# EAGLE design schockink (EAGLE 9.2.0)

## Sheet 1 of 5: PSU
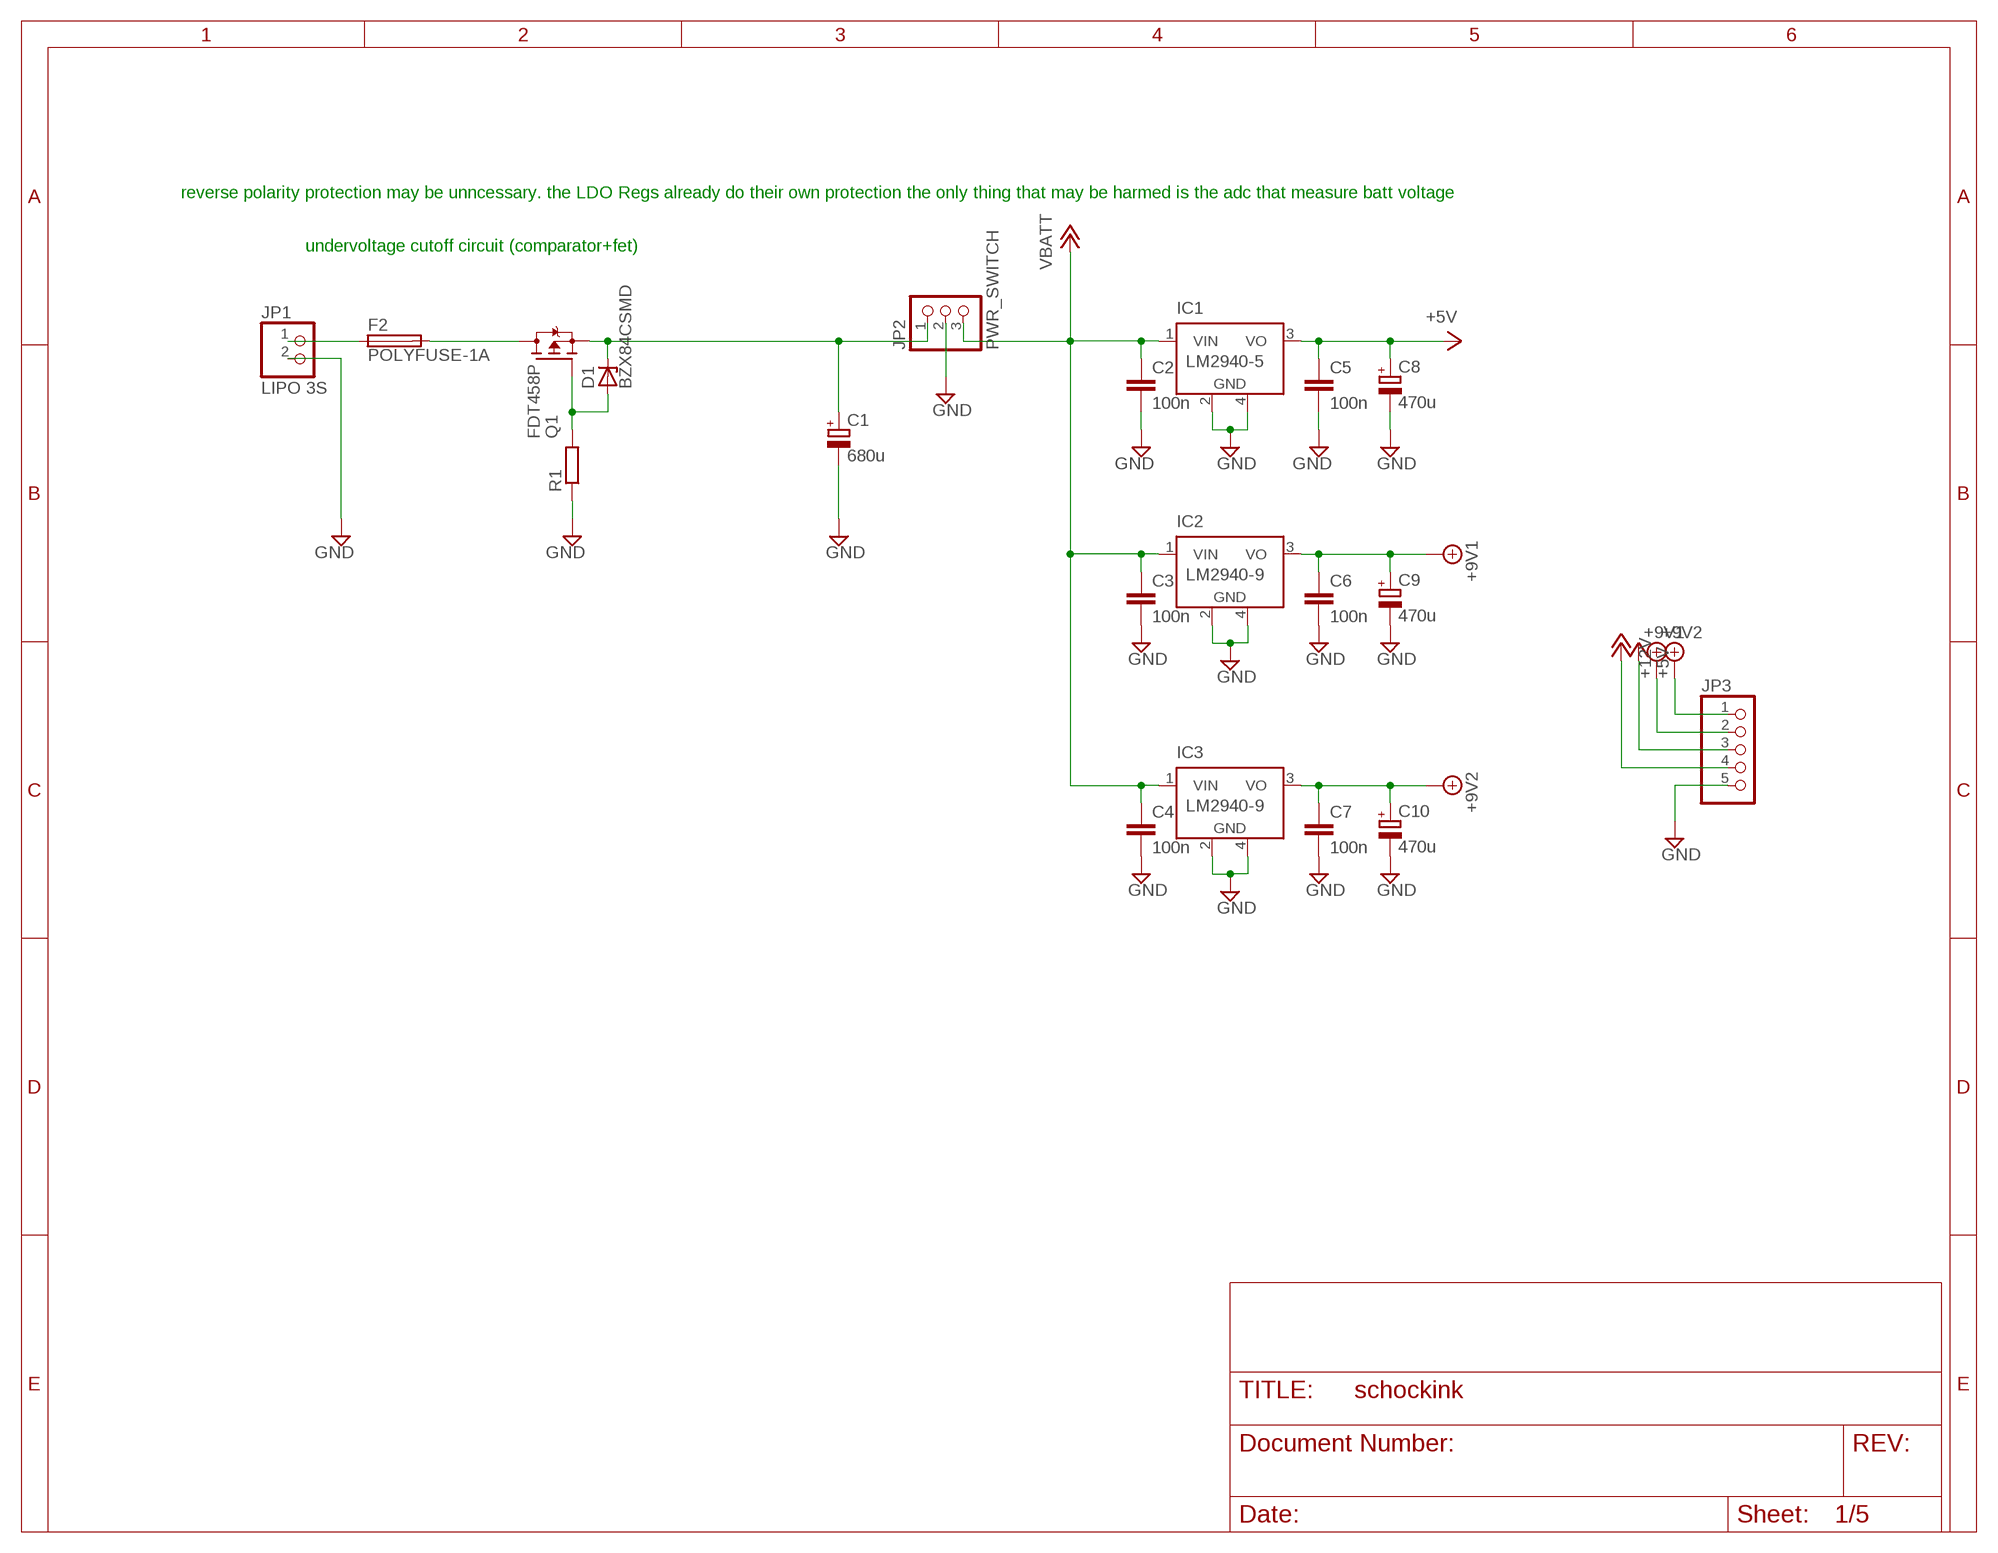
[diagram p0: schematic, sheet 1]

### Parts
C1  680u  CPOL-EUUD-8X10  [UD-8X10_NICHICON]
C2  100n  C-EUC2012  [C2012]
C3  100n  C-EUC2012  [C2012]
C4  100n  C-EUC2012  [C2012]
C5  100n  C-EUC2012  [C2012]
C6  100n  C-EUC2012  [C2012]
C7  100n  C-EUC2012  [C2012]
C8  470u  CPOL-EUUD-6,3X7,7  [UD-6,3X7,7_NICHICON]
C9  470u  CPOL-EUUD-6,3X7,7  [UD-6,3X7,7_NICHICON]
C10  470u  CPOL-EUUD-6,3X7,7  [UD-6,3X7,7_NICHICON]
D1  BZX84CSMD  [TO236]
F2  POLYFUSE-1A  [R1210]
IC1  LM2940-5  LM2936MP-3.3  [SOT223]
IC2  LM2940-9  LM2936MP-3.3  [SOT223]
IC3  LM2940-9  LM2936MP-3.3  [SOT223]
JP1  LIPO 3S  PINHD-1X2  [1X02]
JP2  PWR_SWITCH  PINHD-1X3  [1X03]
JP3  PINHD-1X5  [1X05]
Q1  FDT458P  [SOT223]
R1  R-EU_M2012  [M2012]

### Nets
+5V: C5.1 C8.+ IC1.3(VO) JP3.3 ; also sheet 2,3,4,5
+9V1: C6.1 C9.+ IC2.3(VO) JP3.2 ; also sheet 4
+9V2: C7.1 C10.+ IC3.3(VO) JP3.1 ; also sheet 4
+VBATT: C2.1 C3.1 C4.1 IC1.1(VIN) IC2.1(VIN) IC3.1(VIN) JP2.3 JP3.4 ; supply symbol labelled VBATT, +12V ; also sheet 2,5
GND: C1.- C2.2 C3.2 C4.2 C5.2 C6.2 C7.2 C8.- C9.- C10.- IC1.2(GND) IC1.4(GND) IC2.2(GND) IC2.4(GND) IC3.2(GND) IC3.4(GND) JP1.2 JP2.2 JP3.5 R1.1 ; also sheet 2,3,4,5
N$31: F2.1 JP1.1
N$33: F2.2 Q1.2(D) Q1.4(D)
N$43: D1.A Q1.1(G) R1.2
N$78: C1.+ D1.C JP2.1 Q1.3(S)

### Notes on the sheet
- reverse polarity protection may be unncessary. the LDO Regs already do their own protection the only thing that may be harmed is the adc that measure batt voltage
- undervoltage cutoff circuit (comparator+fet)

## Sheet 2 of 5: ATMEGA MCU
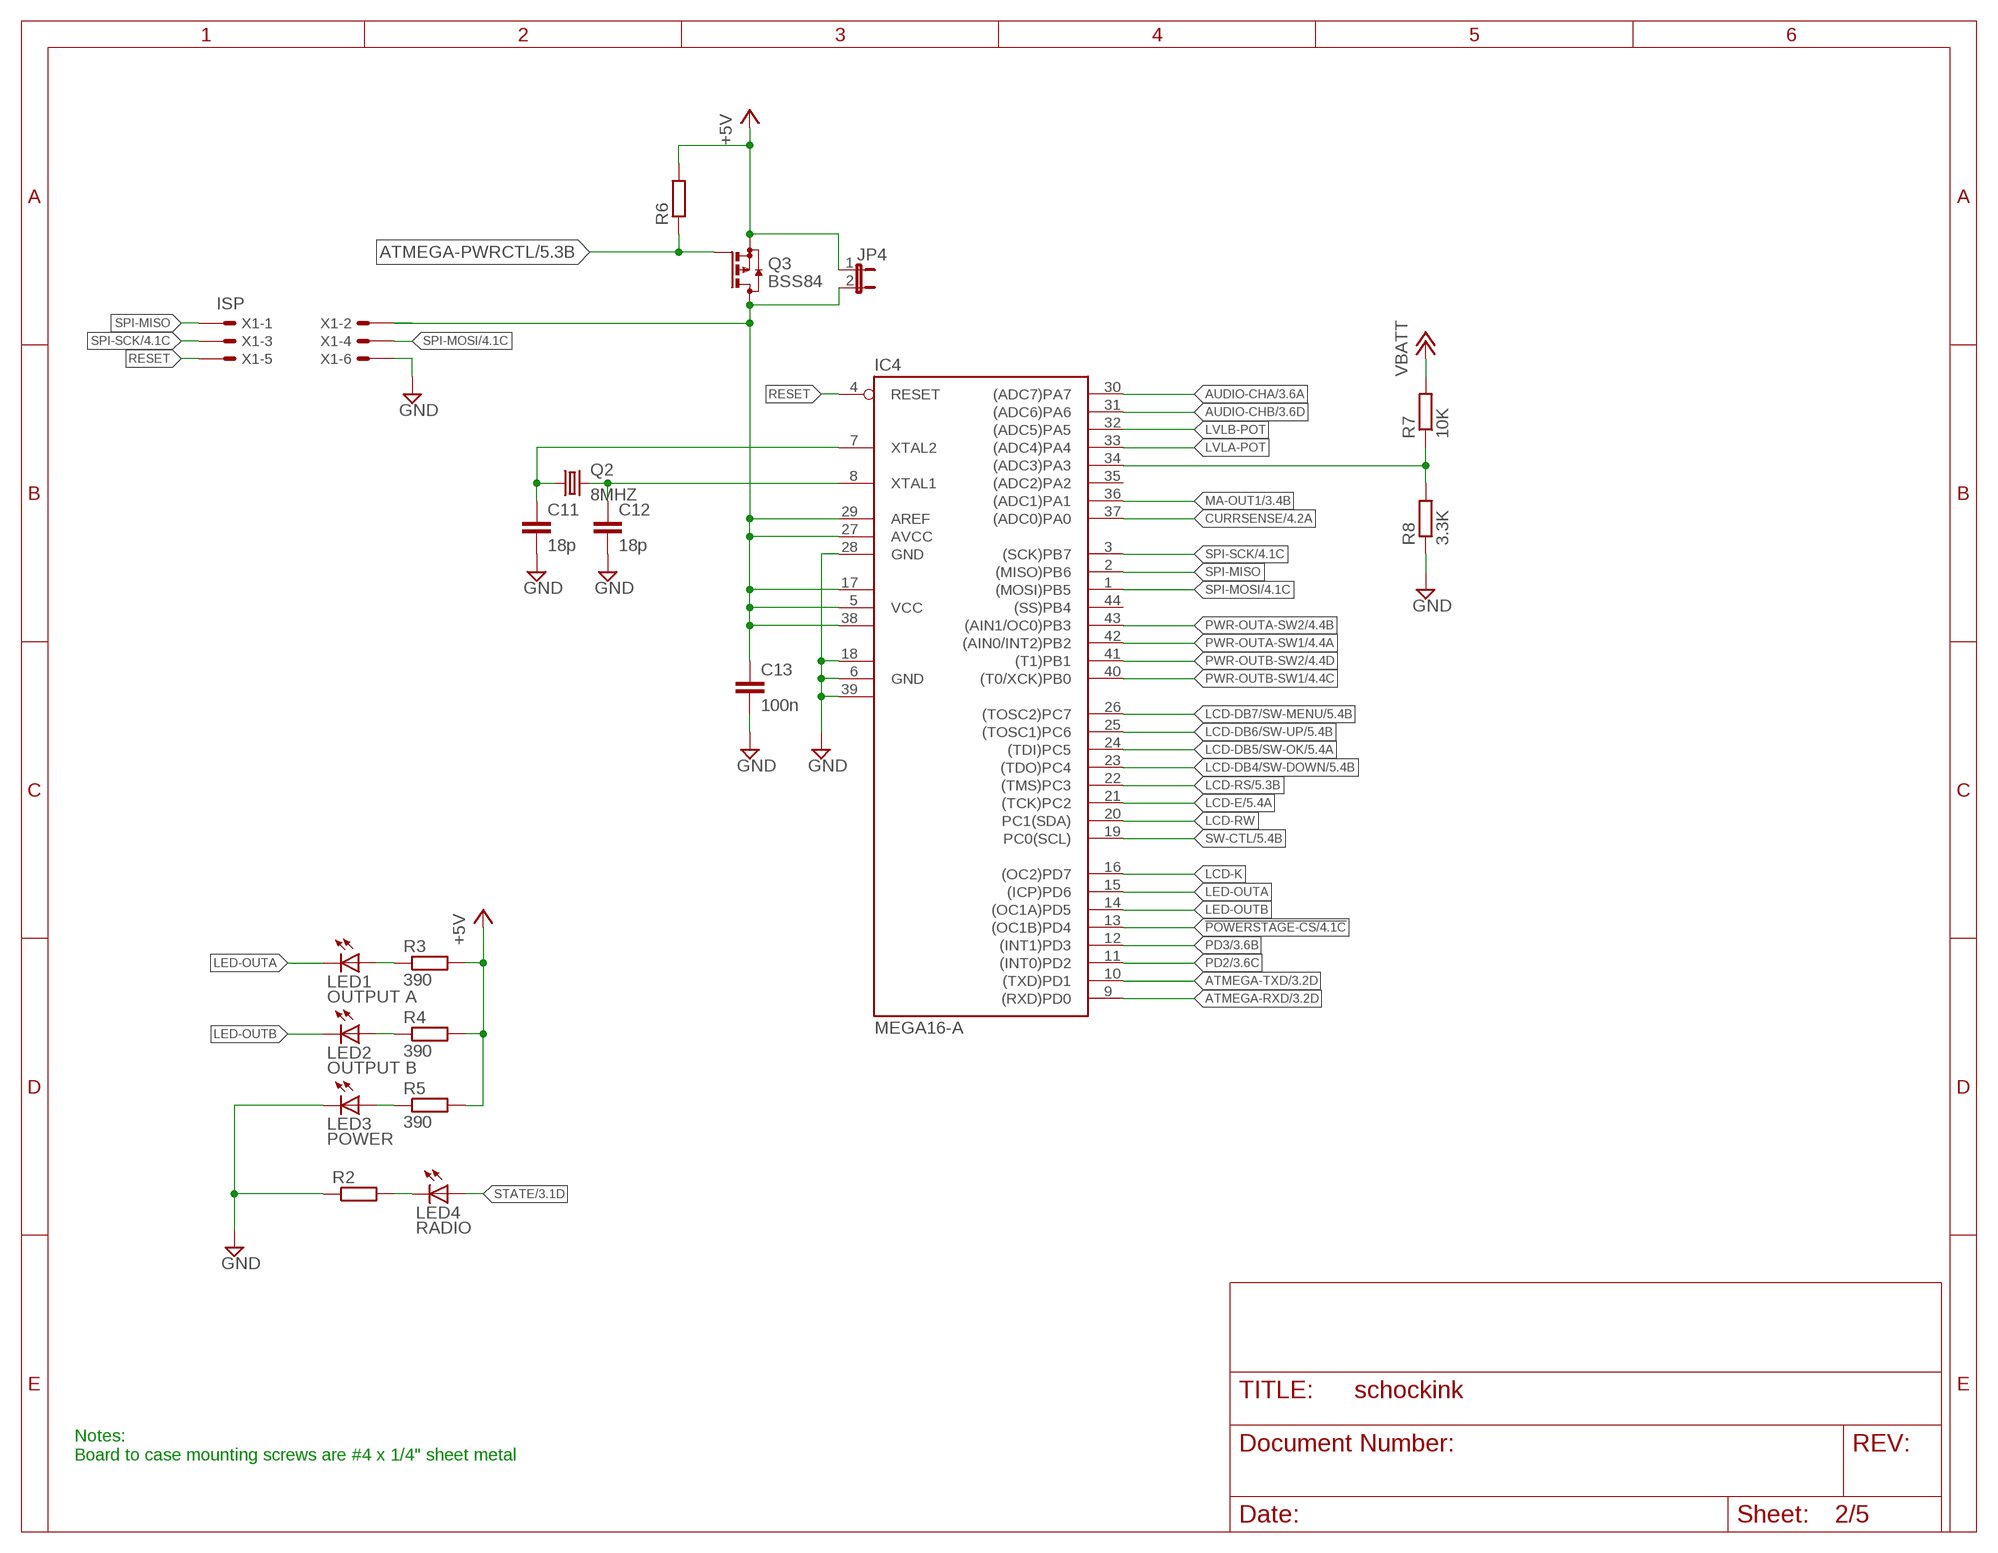
[diagram p1: schematic, sheet 2]

### Parts
C11  18p  C-EUC2012  [C2012]
C12  18p  C-EUC2012  [C2012]
C13  100n  C-EUC2012  [C2012]
IC4  MEGA16-A  [TQFP44]
JP4  JP1E  [JP1]
LED1  OUTPUT A  LEDCHIPLED_0805  [CHIPLED_0805]
LED2  OUTPUT B  LEDCHIPLED_0805  [CHIPLED_0805]
LED3  POWER  LEDCHIPLED_0805  [CHIPLED_0805]
LED4  RADIO  LEDCHIPLED_0805  [CHIPLED_0805]
Q2  8MHZ  CRYSTALCTS406  [CTS406]
Q3  BSS84  [SOT23]
R2  R-EU_M2012  [M2012]
R3  390  R-EU_M2012  [M2012]
R4  390  R-EU_M2012  [M2012]
R5  390  R-EU_M2012  [M2012]
R6  R-EU_M2012  [M2012]
R7  10K  R-EU_M2012  [M2012]
R8  3.3K  R-EU_M2012  [M2012]
X1  ISP  057-006-1  [057-006-1]

### Nets
!POWERSTAGE-CS: IC4.13((OC1B)PD4) ; also sheet 4,5
+5V: JP4.1 Q3.2(S) R3.2 R4.2 R5.2 R6.2 ; also sheet 1,3,4,5
+VBATT: R7.2 ; supply symbol labelled VBATT ; also sheet 1,5
ATMEGA-PWRCTL: Q3.1(G) R6.1 ; also sheet 5
ATMEGA-RXD: IC4.9((RXD)PD0) ; also sheet 3,5
ATMEGA-TXD: IC4.10((TXD)PD1) ; also sheet 3,5
AUDIO-CHA: IC4.30((ADC7)PA7) ; also sheet 3
AUDIO-CHB: IC4.31((ADC6)PA6) ; also sheet 3
CURRSENSE: IC4.37((ADC0)PA0) ; also sheet 4,5
GND: C11.2 C12.2 C13.2 IC4.6(GND) IC4.18(GND1) IC4.28(GND) IC4.39(GND2) LED3.C R2.1 R8.1 X1.6 ; also sheet 1,3,4,5
LCD-DB4/SW-DOWN: IC4.23((TDO)PC4) ; also sheet 5
LCD-DB5/SW-OK: IC4.24((TDI)PC5) ; also sheet 5
LCD-DB6/SW-UP: IC4.25((TOSC1)PC6) ; also sheet 5
LCD-DB7/SW-MENU: IC4.26((TOSC2)PC7) ; also sheet 5
LCD-E: IC4.21((TCK)PC2) ; also sheet 5
LCD-K: IC4.16((OC2)PD7)
LCD-RS: IC4.22((TMS)PC3) ; also sheet 5
LCD-RW: IC4.20(PC1(SDA))
LED-OUTA: IC4.15((ICP)PD6) LED1.C
LED-OUTB: IC4.14((OC1A)PD5) LED2.C
LVLA-POT: IC4.33((ADC4)PA4)
LVLB-POT: IC4.32((ADC5)PA5)
MA-OUT1: IC4.36((ADC1)PA1) ; also sheet 3,5
N$2: IC4.34((ADC3)PA3) R7.1 R8.2
N$5: C13.1 IC4.5(VCC) IC4.17(VCC1) IC4.27(AVCC) IC4.29(AREF) IC4.38(VCC2) JP4.2 Q3.3(D) X1.2
N$7: LED4.C R2.2
N$17: C12.1 IC4.8(XTAL1) Q2.3
N$23: LED2.A R4.1
N$29: LED1.A R3.1
N$32: C11.1 IC4.7(XTAL2) Q2.1
N$81: LED3.A R5.1
PD2: IC4.11((INT0)PD2) ; also sheet 3
PD3: IC4.12((INT1)PD3) ; also sheet 3
PWR-OUTA-SW1: IC4.42((AIN0/INT2)PB2) ; also sheet 4,5
PWR-OUTA-SW2: IC4.43((AIN1/OC0)PB3) ; also sheet 4,5
PWR-OUTB-SW1: IC4.40((T0/XCK)PB0) ; also sheet 4,5
PWR-OUTB-SW2: IC4.41((T1)PB1) ; also sheet 4,5
RESET: IC4.4(RESET) X1.5
SPI-MISO: IC4.2((MISO)PB6) X1.1
SPI-MOSI: IC4.1((MOSI)PB5) X1.4 ; also sheet 4,5
SPI-SCK: IC4.3((SCK)PB7) X1.3 ; also sheet 4,5
STATE: LED4.A ; also sheet 3
SW-CTL: IC4.19(PC0(SCL)) ; also sheet 5
Unconnected: IC4.35((ADC2)PA2) IC4.44((SS)PB4)

### Notes on the sheet
- Notes:
  Board to case mounting screws are #4 x 1/4" sheet metal

## Sheet 3 of 5: Input stage
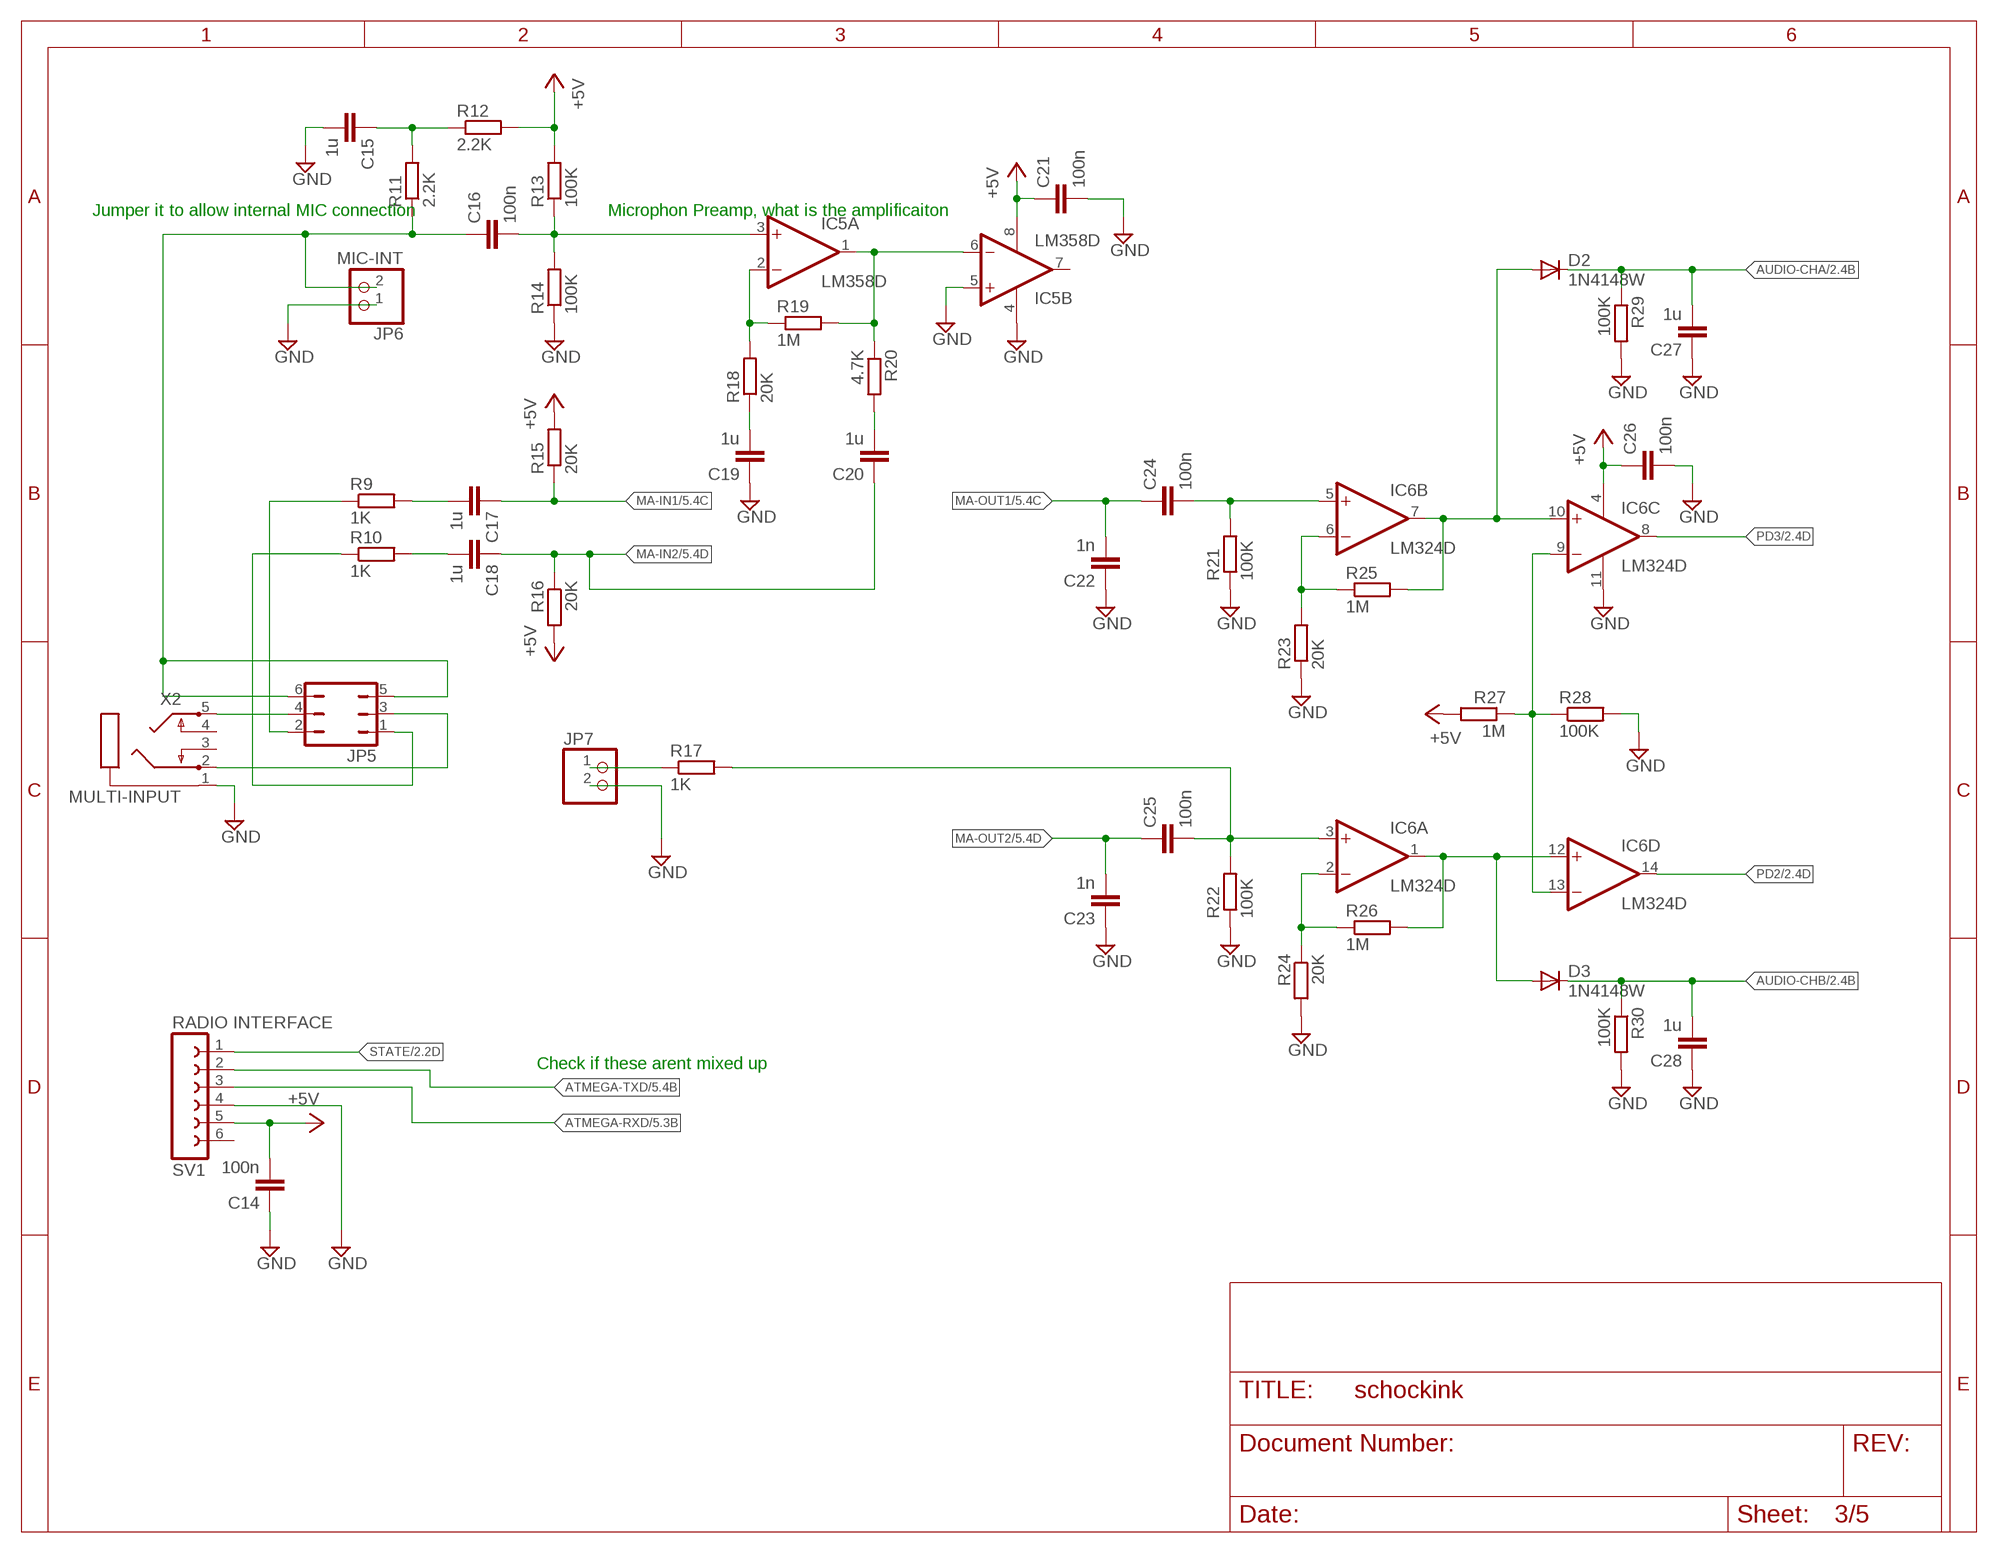
[diagram p2: schematic, sheet 3]

### Parts
C14  100n  C-EUC2012  [C2012]
C15  1u  C-EUC2012  [C2012]
C16  100n  C-EUC2012  [C2012]
C17  1u  C-EUC2012  [C2012]
C18  1u  C-EUC2012  [C2012]
C19  1u  C-EUC2012  [C2012]
C20  1u  C-EUC2012  [C2012]
C21  100n  C-EUC2012  [C2012]
C22  1n  C-EUC2012  [C2012]
C23  1n  C-EUC2012  [C2012]
C24  100n  C-EUC2012  [C2012]
C25  100n  C-EUC2012  [C2012]
C26  100n  C-EUC2012  [C2012]
C27  1u  C-EUC2012  [C2012]
C28  1u  C-EUC2012  [C2012]
D2  1N4148W  CGRM4001-G  [SOD-123_MINI-SMA]
D3  1N4148W  CGRM4001-G  [SOD-123_MINI-SMA]
IC5  LM358D  [SO08]
IC6  LM324D  [SO14]
JP5  JP3Q  [JP3Q]
JP6  MIC-INT  PINHD-1X2  [1X02]
JP7  PINHD-1X2  [1X02]
R9  1K  R-EU_M2012  [M2012]
R10  1K  R-EU_M2012  [M2012]
R11  2.2K  R-EU_M2012  [M2012]
R12  2.2K  R-EU_M2012  [M2012]
R13  100K  R-EU_M2012  [M2012]
R14  100K  R-EU_M2012  [M2012]
R15  20K  R-EU_M2012  [M2012]
R16  20K  R-EU_M2012  [M2012]
R17  1K  R-EU_M2012  [M2012]
R18  20K  R-EU_M2012  [M2012]
R19  1M  R-EU_M2012  [M2012]
R20  4.7K  R-EU_M2012  [M2012]
R21  100K  R-EU_M2012  [M2012]
R22  100K  R-EU_M2012  [M2012]
R23  20K  R-EU_M2012  [M2012]
R24  20K  R-EU_M2012  [M2012]
R25  1M  R-EU_M2012  [M2012]
R26  1M  R-EU_M2012  [M2012]
R27  1M  R-EU_M2012  [M2012]
R28  100K  R-EU_M2012  [M2012]
R29  100K  R-EU_M2012  [M2012]
R30  100K  R-EU_M2012  [M2012]
SV1  RADIO INTERFACE  FE06-1  [FE06]
X2  MULTI-INPUT  STEREOJACK  [STX3100]

### Nets
+5V: C14.2 C21.1 C26.1 IC5.8(P:V+) IC6.4(P:V+) R12.2 R13.2 R15.2 R16.2 R27.2 SV1.5 ; also sheet 1,2,4,5
ATMEGA-RXD: SV1.3 ; also sheet 2,5
ATMEGA-TXD: SV1.2 ; also sheet 2,5
AUDIO-CHA: C27.2 D2.C R29.1 ; also sheet 2
AUDIO-CHB: C28.2 D3.C R30.1 ; also sheet 2
GND: C14.1 C15.2 C19.1 C21.2 C22.1 C23.1 C26.2 C27.1 C28.1 IC5.4(P:V-) IC5.5(B:+IN) IC6.11(P:V-) JP6.1 JP7.2 R14.1 R21.1 R22.1 R23.1 R24.2 R28.2 R29.2 R30.2 SV1.4 X2.1 ; also sheet 1,2,4,5
MA-IN1: C17.1 R15.1 ; also sheet 5
MA-IN2: C18.1 C20.1 R16.1 ; also sheet 5
MA-OUT1: C22.2 C24.1 ; also sheet 2,5
MA-OUT2: C23.2 C25.1 ; also sheet 5
N$3: JP7.1 R17.1
N$12: JP5.4 X2.5
N$13: JP5.3 X2.2
N$14: C25.2 IC6.3(A:+IN) R17.2 R22.2
N$15: JP5.2 R9.1
N$30: JP5.1 R10.1
N$49: C19.2 R18.1
N$53: IC6.2(A:-IN) R24.1 R26.1
N$54: D3.A IC6.1(A:OUT) IC6.12(D:+IN) R26.2
N$57: C17.2 R9.2
N$60: IC6.6(B:-IN) R23.2 R25.1
N$62: IC6.9(C:-IN) IC6.13(D:-IN) R27.1 R28.1
N$63: C24.2 IC6.5(B:+IN) R21.2
N$65: C18.2 R10.2
N$69: D2.A IC6.7(B:OUT) IC6.10(C:+IN) R25.2
N$71: C16.1 JP5.5 JP5.6 JP6.2 R11.1
N$72: C15.1 R11.2 R12.1
N$73: C16.2 IC5.3(A:+IN) R13.1 R14.2
N$74: IC5.2(A:-IN) R18.2 R19.1
N$75: IC5.1(A:OUT) IC5.6(B:-IN) R19.2 R20.1
N$76: C20.2 R20.2
PD2: IC6.14(D:OUT) ; also sheet 2
PD3: IC6.8(C:OUT) ; also sheet 2
STATE: SV1.1 ; also sheet 2
Unconnected: IC5.7(B:OUT) SV1.6 X2.3 X2.4

### Notes on the sheet
- Jumper it to allow internal MIC connection | Microphon Preamp, what is the amplificaiton
- Check if these arent mixed up

## Sheet 4 of 5: Output stage
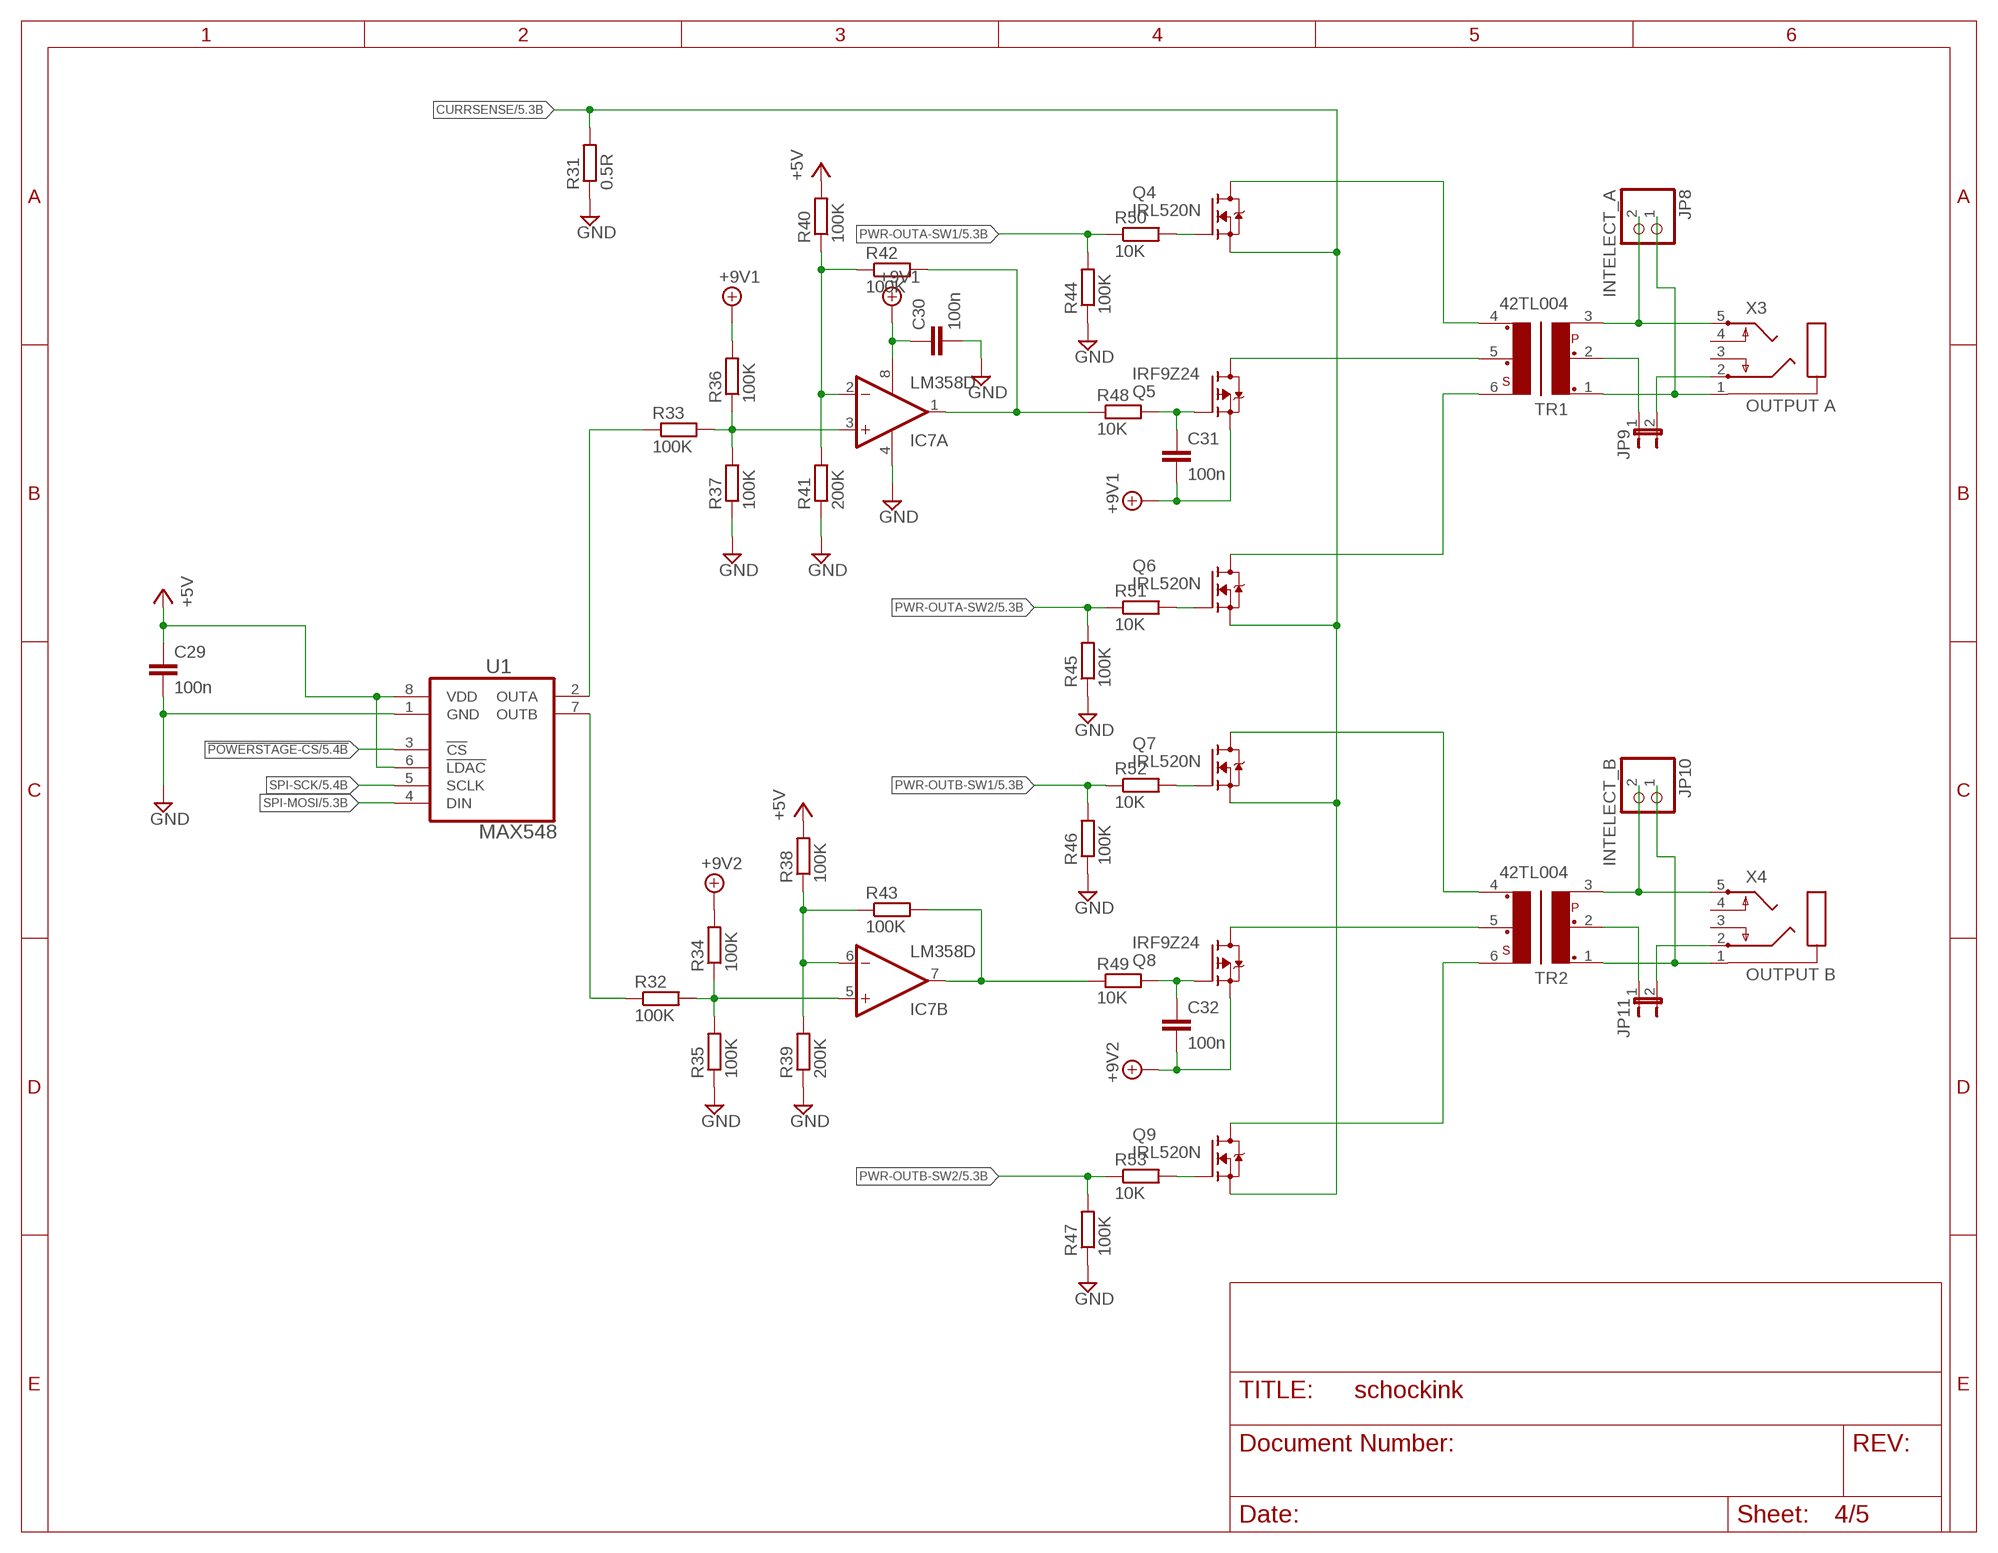
[diagram p3: schematic, sheet 4]

### Parts
C29  100n  C-EUC2012  [C2012]
C30  100n  C-EUC2012  [C2012]
C31  100n  C-EUC2012  [C2012]
C32  100n  C-EUC2012  [C2012]
IC7  LM358D  [SO08]
JP8  INTELECT_A  PINHD-1X2  [1X02]
JP9  JP1E  [JP1]
JP10  INTELECT_B  PINHD-1X2  [1X02]
JP11  JP1E  [JP1]
Q4  IRL520N  [TO263]
Q5  IRF9Z24  [TO263]
Q6  IRL520N  [TO263]
Q7  IRL520N  [TO263]
Q8  IRF9Z24  [TO263]
Q9  IRL520N  [TO263]
R31  0.5R  R-EU_M2012  [M2012]
R32  100K  R-EU_M2012  [M2012]
R33  100K  R-EU_M2012  [M2012]
R34  100K  R-EU_M2012  [M2012]
R35  100K  R-EU_M2012  [M2012]
R36  100K  R-EU_M2012  [M2012]
R37  100K  R-EU_M2012  [M2012]
R38  100K  R-EU_M2012  [M2012]
R39  200K  R-EU_M2012  [M2012]
R40  100K  R-EU_M2012  [M2012]
R41  200K  R-EU_M2012  [M2012]
R42  100K  R-EU_M2012  [M2012]
R43  100K  R-EU_M2012  [M2012]
R44  100K  R-EU_M2012  [M2012]
R45  100K  R-EU_M2012  [M2012]
R46  100K  R-EU_M2012  [M2012]
R47  100K  R-EU_M2012  [M2012]
R48  10K  R-EU_M2012  [M2012]
R49  10K  R-EU_M2012  [M2012]
R50  10K  R-EU_M2012  [M2012]
R51  10K  R-EU_M2012  [M2012]
R52  10K  R-EU_M2012  [M2012]
R53  10K  R-EU_M2012  [M2012]
TR1  42TL004  42TL023  [42TL]
TR2  42TL004  42TL023  [42TL]
U1  MAX548  [UMAX8]
X3  OUTPUT A  STEREOJACK  [STX3100]
X4  OUTPUT B  STEREOJACK  [STX3100]

### Nets
!POWERSTAGE-CS: U1.3(!CS) ; also sheet 2,5
+5V: C29.1 R38.2 R40.2 U1.6(!LDAC) U1.8(VDD) ; also sheet 1,2,3,5
+9V1: C30.1 C31.2 IC7.8(P:V+) Q5.2(S) R36.2 ; also sheet 1
+9V2: C32.2 Q8.2(S) R34.2 ; also sheet 1
CURRSENSE: Q4.2(S) Q6.2(S) Q7.2(S) Q9.2(S) R31.2 ; also sheet 2,5
GND: C29.2 C30.2 IC7.4(P:V-) R31.1 R35.1 R37.1 R39.1 R41.1 R44.1 R45.1 R46.1 R47.1 U1.1(GND) ; also sheet 1,2,3,5
N$6: Q5.3(D) TR1.5
N$8: Q8.3(D) TR2.5
N$9: JP11.1 TR2.2
N$16: JP8.1 TR1.1 X3.1
N$18: Q4.1(G) R50.2
N$19: Q6.1(G) R51.2
N$20: JP11.2 X4.2
N$21: C31.1 Q5.1(G) R48.2
N$22: IC7.3(A:+IN) R33.2 R36.1 R37.2
N$24: Q7.1(G) R52.2
N$25: Q9.1(G) R53.2
N$26: JP10.1 TR2.1 X4.1
N$27: C32.1 Q8.1(G) R49.2
N$28: IC7.5(B:+IN) R32.2 R34.1 R35.2
N$34: Q4.3(D) TR1.4
N$35: JP8.2 TR1.3 X3.5
N$36: Q7.3(D) TR2.4
N$37: JP10.2 TR2.3 X4.5
N$38: Q9.3(D) TR2.6
N$39: Q6.3(D) TR1.6
N$40: IC7.2(A:-IN) R40.1 R41.2 R42.1
N$41: IC7.6(B:-IN) R38.1 R39.2 R43.1
N$42: R33.1 U1.2(OUTA)
N$48: JP9.2 X3.2
N$51: JP9.1 TR1.2
N$85: R32.1 U1.7(OUTB)
PFET_A: IC7.1(A:OUT) R42.2 R48.1
PFET_B: IC7.7(B:OUT) R43.2 R49.1
PWR-OUTA-SW1: R44.2 R50.1 ; also sheet 2,5
PWR-OUTA-SW2: R45.2 R51.1 ; also sheet 2,5
PWR-OUTB-SW1: R46.2 R52.1 ; also sheet 2,5
PWR-OUTB-SW2: R47.2 R53.1 ; also sheet 2,5
SPI-MOSI: U1.4(DIN) ; also sheet 2,5
SPI-SCK: U1.5(SCLK) ; also sheet 2,5
Unconnected: X3.3 X3.4 X4.3 X4.4

## Sheet 5 of 5: ESP32 MCU
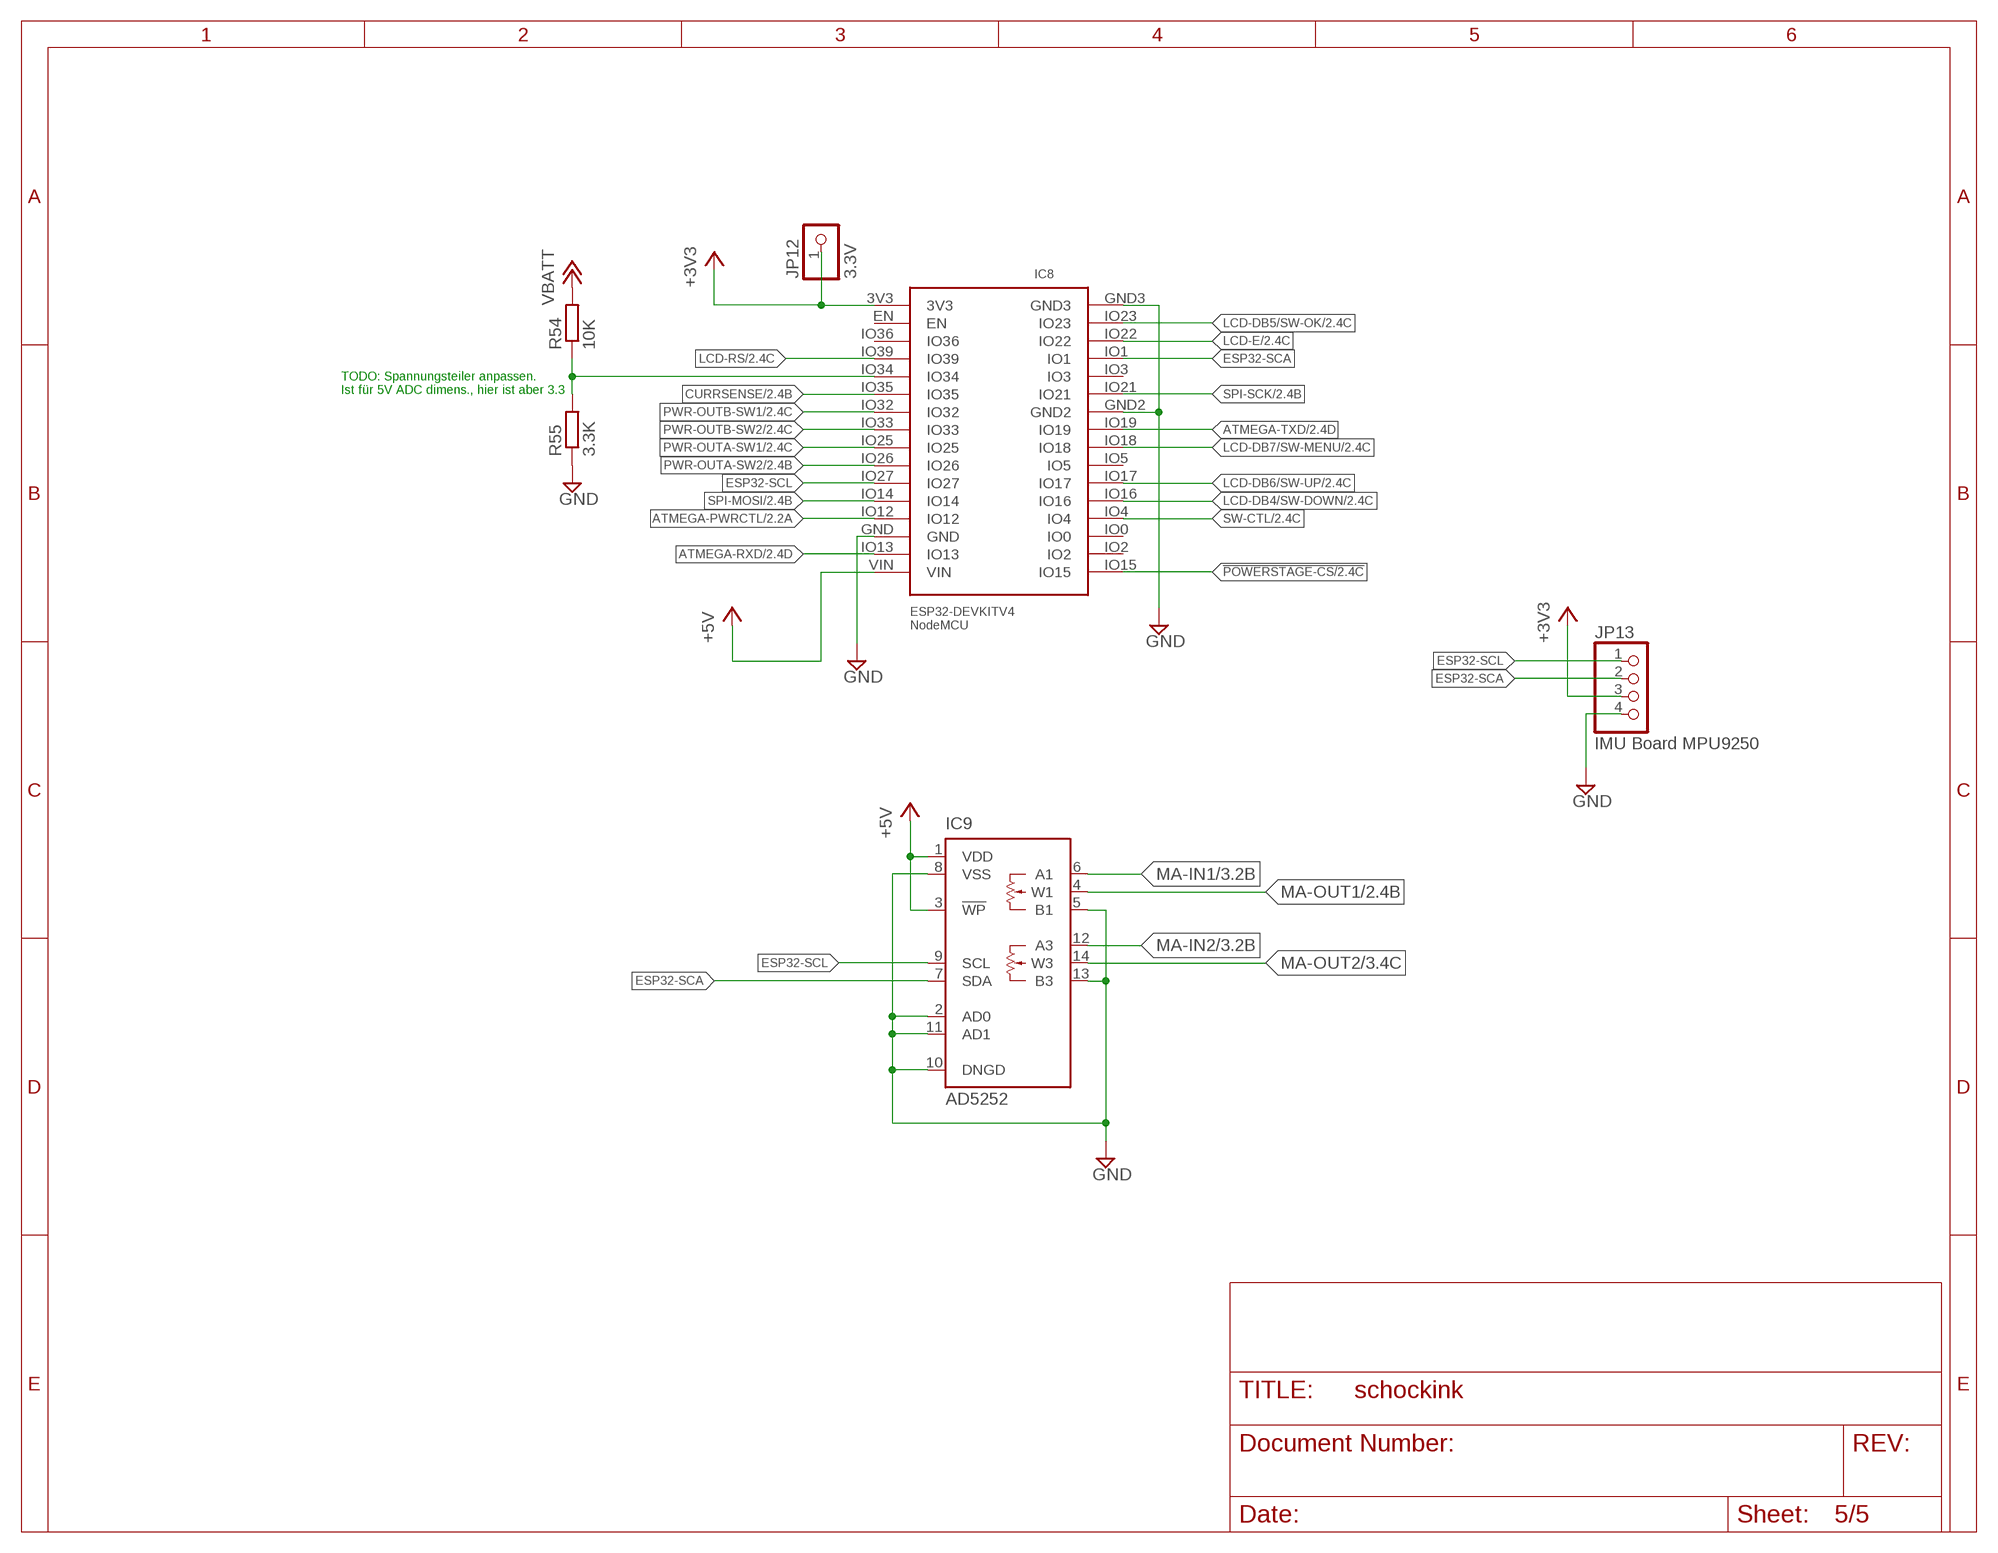
[diagram p4: schematic, sheet 5]

### Parts
IC8  ESP32DEVKIT  [ESP32-DEVKIT]
IC9  AD5252  [TSSOP14]
JP12  3.3V  PINHD-1X1  [1X01]
JP13  IMU Board MPU9250  PINHD-1X4  [1X04]
R54  10K  R-EU_M2012  [M2012]
R55  3.3K  R-EU_M2012  [M2012]

### Nets
!POWERSTAGE-CS: IC8.IO15 ; also sheet 2,4
+3V3: IC8.3V3 JP12.1 JP13.3
+5V: IC8.VIN IC9.1(VDD) IC9.3(!WP) ; also sheet 1,2,3,4
+VBATT: R54.2 ; supply symbol labelled VBATT ; also sheet 1,2
ATMEGA-PWRCTL: IC8.IO12 ; also sheet 2
ATMEGA-RXD: IC8.IO13 ; also sheet 2,3
ATMEGA-TXD: IC8.IO19 ; also sheet 2,3
CURRSENSE: IC8.IO35 ; also sheet 2,4
ESP32-SCA: IC8.IO1 IC9.7(SDA) JP13.2
ESP32-SCL: IC8.IO27 IC9.9(SCL) JP13.1
GND: IC8.GND IC8.GND2 IC8.GND3 IC9.2(AD0) IC9.5(B1) IC9.8(VSS) IC9.10(DNGD) IC9.11(AD1) IC9.13(B3) JP13.4 R55.1 ; also sheet 1,2,3,4
LCD-DB4/SW-DOWN: IC8.IO16 ; also sheet 2
LCD-DB5/SW-OK: IC8.IO23 ; also sheet 2
LCD-DB6/SW-UP: IC8.IO17 ; also sheet 2
LCD-DB7/SW-MENU: IC8.IO18 ; also sheet 2
LCD-E: IC8.IO22 ; also sheet 2
LCD-RS: IC8.IO39 ; also sheet 2
MA-IN1: IC9.6(A1) ; also sheet 3
MA-IN2: IC9.12(A3) ; also sheet 3
MA-OUT1: IC9.4(W1) ; also sheet 2,3
MA-OUT2: IC9.14(W3) ; also sheet 3
N$4: IC8.IO34 R54.1 R55.2
PWR-OUTA-SW1: IC8.IO25 ; also sheet 2,4
PWR-OUTA-SW2: IC8.IO26 ; also sheet 2,4
PWR-OUTB-SW1: IC8.IO32 ; also sheet 2,4
PWR-OUTB-SW2: IC8.IO33 ; also sheet 2,4
SPI-MOSI: IC8.IO14 ; also sheet 2,4
SPI-SCK: IC8.IO21 ; also sheet 2,4
SW-CTL: IC8.IO4 ; also sheet 2
Unconnected: IC8.EN IC8.IO0 IC8.IO2 IC8.IO3 IC8.IO5 IC8.IO36

### Notes on the sheet
- TODO: Spannungsteiler anpassen.
  Ist für 5V ADC dimens., hier ist aber 3.3

## Library data of the parts
C1 C8-C10 = rcl:CPOL-EU: POLARIZED CAPACITOR, European symbol; SPICEPREFIX: C
C2-C7 C11-C13 C29-C32 = rcl:C-EU: CAPACITOR, European symbol; SPICEPREFIX: C
C14-C28 = resistor:C-EU: CAPACITOR, European symbol
D1 = diode:BZX84CSMD: Z DIODE
D2 D3 = diode:CGRM400*-G: Molded plasitc,JEDEC SOD-123/Mini SMA Source: Comchip CGRM4001-G.pdf
F2 = disdev:POLYFUSE-1A
IC1-IC3 = national-semiconductor:LM2936MP?*: Ultra-Low Quiescent Current LDO Voltage Regulator Source: Data sheet <http://www.national.com/ds/LM/LM2936.pdf>; MF: NATIONAL SEMICONDUCTOR; MPN: LM2936MP-3.3/NOPB; OC_FARNELL: 1469062; OC_NEWARK: 41K4523
IC4 = atmel:MEGA16: MICROCONTROLLER 16 Kbytes FLASH 1 kbytes SRAM 512 bytes EEPROM USART 8-channel 10 bit ADC Source: avr.lbr; MPN: ATMEGA16-16AU; OC_FARNELL: 9171134; OC_NEWARK: 96K6515
IC5 IC7 = linear:LM358: OP AMP also LM158; LM258; LM2904 Source: http://cache.national.com/ds/LM/LM158.pdf
IC6 = linear:LM324: OP AMP
IC8 = disdev:ESP32DEVKIT
IC9 = disdev:AD5252: AD5252 Dual DigPot
JP1 JP6-JP8 JP10 = pinhead:PINHD-1X2: PIN HEADER
JP2 = pinhead:PINHD-1X3: PIN HEADER
JP3 = pinhead:PINHD-1X5: PIN HEADER
JP4 JP9 JP11 = jumper:JP1E: JUMPER
JP5 = jumper:JP3Q: JUMPER
JP12 = pinhead:PINHD-1X1: PIN HEADER
JP13 = pinhead:PINHD-1X4: PIN HEADER
LED1-LED4 = led:LED: LED OSRAM: - CHIPLED LG R971, LG N971, LY N971, LG Q971, LY Q971, LO R971, LY R971 LH N974, LH R974 LS Q976, LO Q976, LY Q976 LO Q996 - Hyper CHIPLED LW Q18S LB Q993, LB Q99A, LB R99A - SideLED LS A670, LO A670, LY A670, LG A670, LP A670 LB A673, LV A673, LT A673, LW A673 LH A674 LY A675 LS A676, LA A676, LO A676, LY A676, LW A676 LS A679, LY A679, LG A679 - Hyper Micro SIDELED® LS Y876, LA Y876, LO Y876, LY Y876 LT Y87S - SmartLED LW L88C, LW L88S LB L89C, LB L89S, LG L890 LS L89K, LO L89K, LY L89K LS L896, LA L896, LO L896, LY L896 - TOPLED LS T670, LO T670, LY T670, LG T670, LP T670 LSG T670, LSP T670, LSY T670, LOP T670, LYG T670 LG T671, LOG T671, LSG T671 LB T673, LV T673, LT T673, LW T673 LH T674 LS T676, LA T676, LO T676, LY T676, LB T676, LH T676, LSB T676, LW T676 LB T67C, LV T67C, LT T67C, LS T67K, LO T67K, LY T67K, LW E67C LS E67B, LA E67B, LO E67B, LY E67B, LB E67C, LV E67C, LT E67C LW T67C LS T679, LY T679, LG T679 LS T770, LO T770, LY T770, LG T770, LP T770 LB T773, LV T773, LT T773, LW T773 LH T774 LS E675, LA E675, LY E675, LS T675 LS T776, LA T776, LO T776, LY T776, LB T776 LHGB T686 LT T68C, LB T68C - Hyper Mini TOPLED® LB M676 - Mini TOPLED Santana® LG M470 LS M47K, LO M47K, LY M47K Source: http://www.osram.convergy.de LUXEON: - LUMILED® LXK2-PW12-R00, LXK2-PW12-S00, LXK2-PW14-U00, LXK2-PW14-V00 LXK2-PM12-R00, LXK2-PM12-S00, LXK2-PM14-U00 LXK2-PE12-Q00, LXK2-PE12-R00, LXK2-PE12-S00, LXK2-PE14-T00, LXK2-PE14-U00 LXK2-PB12-K00, LXK2-PB12-L00, LXK2-PB12-M00, LXK2-PB14-N00, LXK2-PB14-P00, LXK2-PB14-Q00 LXK2-PR12-L00, LXK2-PR12-M00, LXK2-PR14-Q00, LXK2-PR14-R00 LXK2-PD12-Q00, LXK2-PD12-R00, LXK2-PD12-S00 LXK2-PH12-R00, LXK2-PH12-S00 LXK2-PL12-P00, LXK2-PL12-Q00, LXK2-PL12-R00 Source: www.luxeon.com KINGBRIGHT: KA-3528ASYC Source: www.kingbright.com
Q1 = disdev:FDT458P; MOUSER#: 512-FDT458P
Q2 = crystal:CRYSTAL: CRYSTAL; OC_FARNELL: unknown; OC_NEWARK: unknown
Q3 = transistor-small-signal:BSS84: P-CHANNEL MOS FET
Q4 Q6 Q7 Q9 = disdev:IRL520N
Q5 Q8 = disdev:IRF9Z24
R1-R55 = rcl:R-EU_: RESISTOR, European symbol; SPICEPREFIX: R
SV1 = con-lsta:FE06-1: FEMALE HEADER; OC_FARNELL: unknown; OC_NEWARK: unknown
TR1 TR2 = trafo-xicon:42T?*: Xicon Micro-Mini EI-12 Audio Transformers 42TL/42TC/42TM Series Source: http://www.mouser.com//catalog/specsheets/164201.pdf http://www.mouser.com/catalog/specsheets/114225.pdf http://www.mouser.com/catalog/specsheets/164267.pdf; MOUSER#: 42TL004-RC; OC_FARNELL: unknown; OC_NEWARK: unknown
U1 = disdev:MAX548: Delay Line
X1 = con-panduit:057-006-: CONNECTOR 6-pin series 057 contact pc board low profile headers; OC_FARNELL: unknown; OC_NEWARK: unknown
X2-X4 = adafruit:STEREOJACK: MIC/HEADPHONE JACK Stereo jack with two switches. Kycon STX3100, CUI SJ1-3555NG and/or 4UCon 05544

## Net classes
0 default: width 0.203 mm, clearance 0.152 mm
1 signal: width 0.203 mm, clearance 0.152 mm
2 pwr: width 0.203 mm, clearance 0.152 mm

## Board
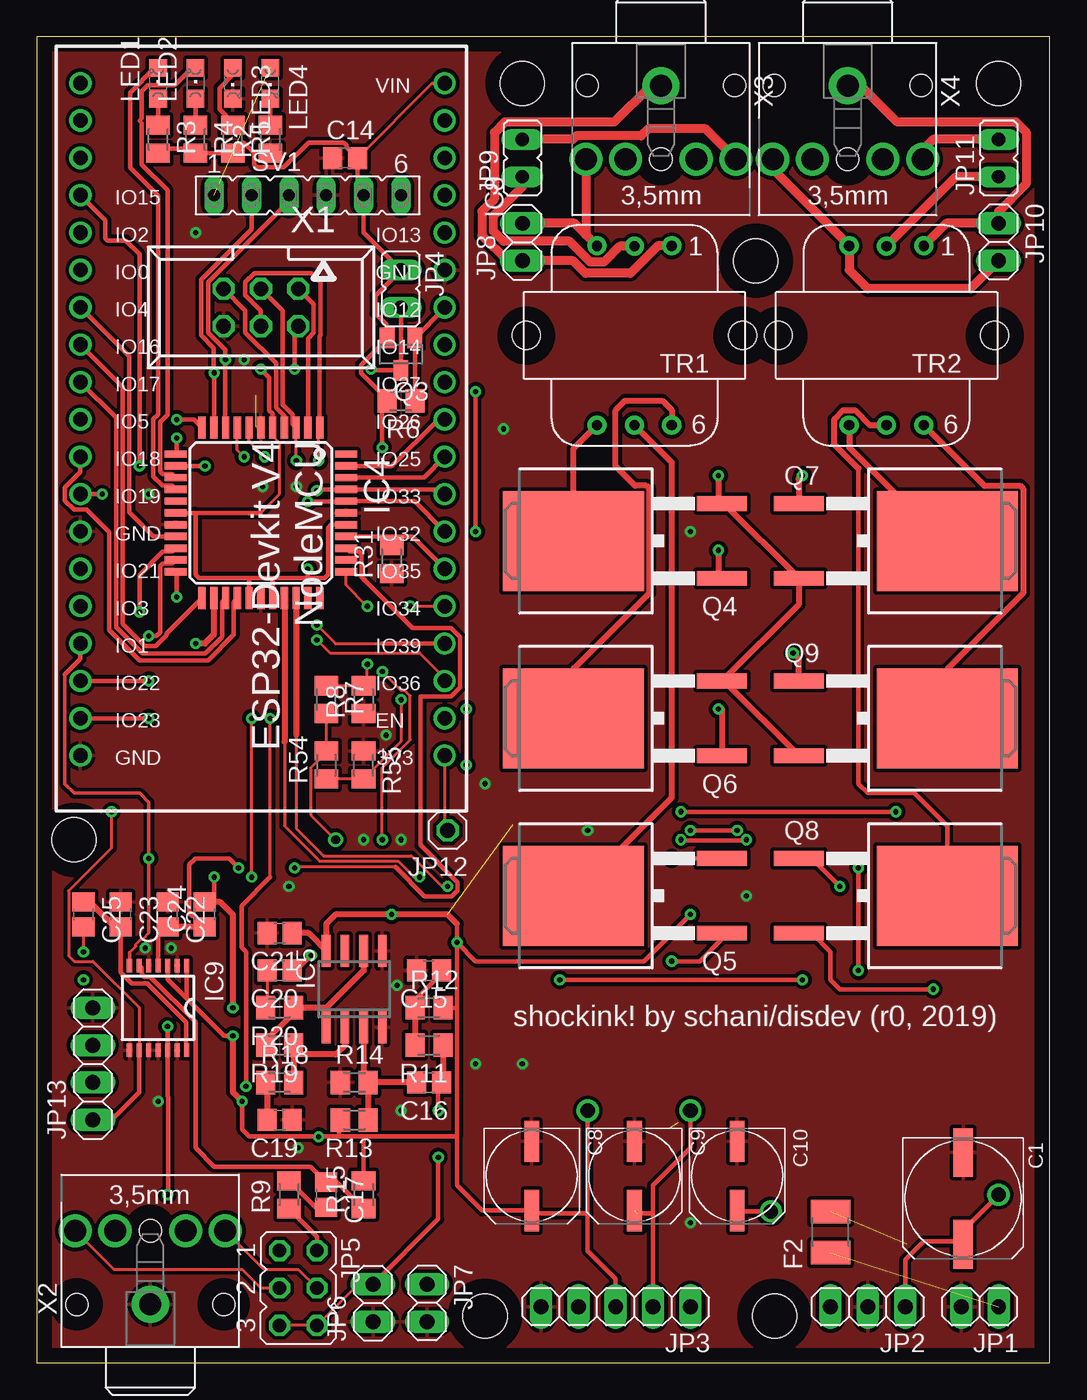
[diagram p5: board, top side]
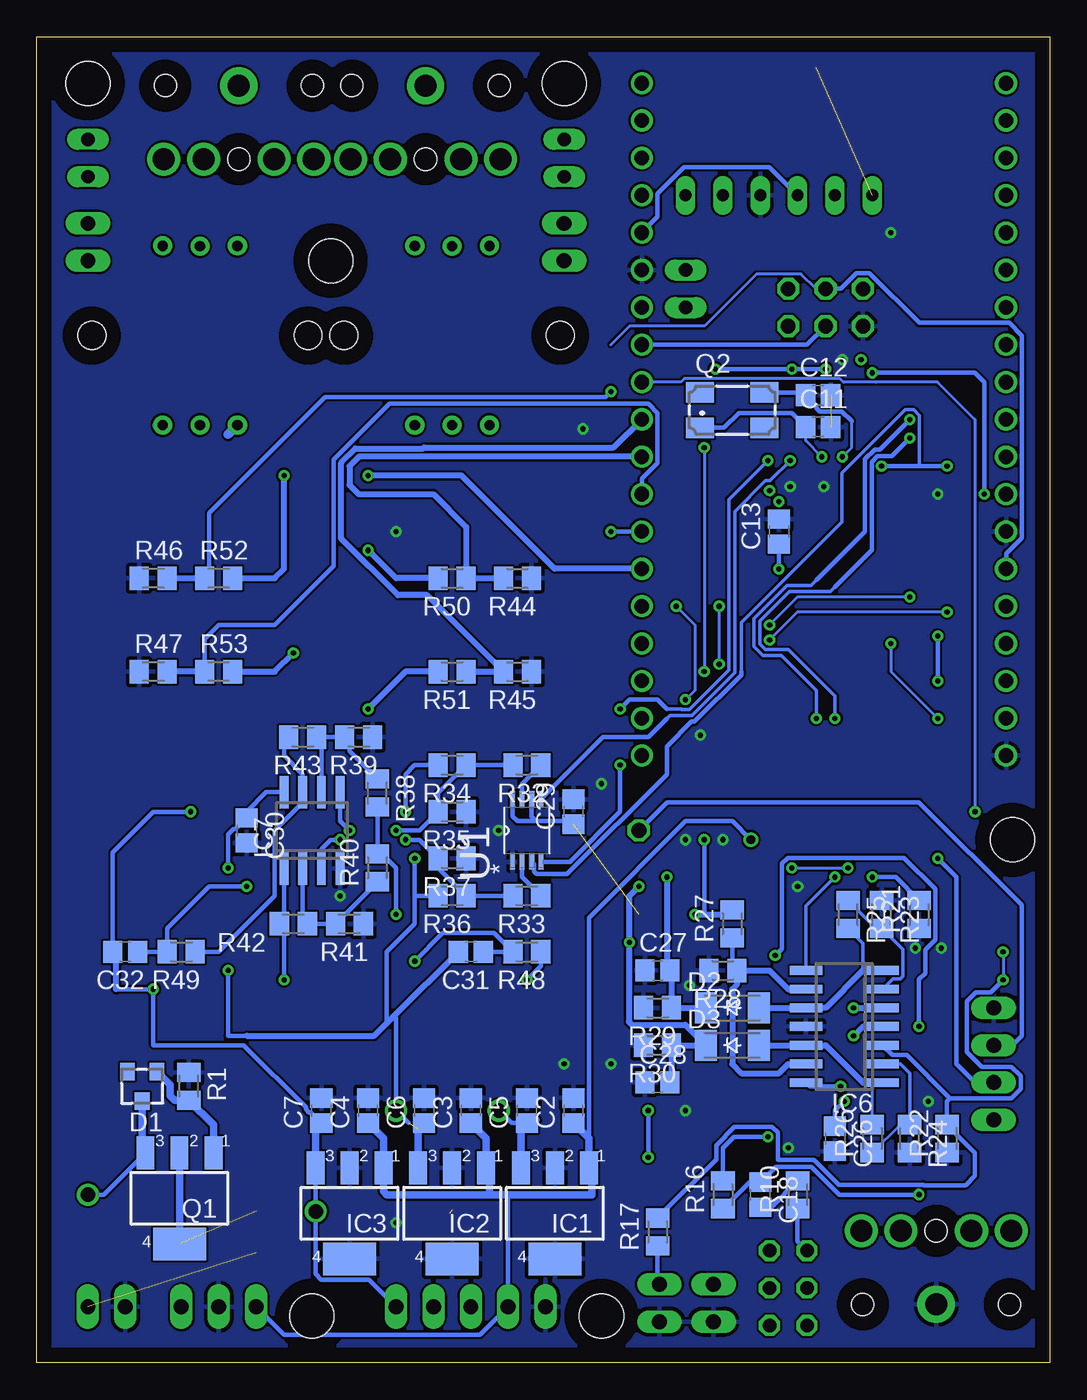
[diagram p6: board, bottom side, seen from below]

Size 68.89 x 90.16 mm. Coordinates in mm from the lower left corner, seen from the top.
Outline: 0,0 68.89,0 68.89,90.16 0,90.16 0,0
Copper layers (1*16): Top 0.035mm / dielectric 1.5mm / Bottom 0.035mm
Design rules "default *": minimum track width 6mil, minimum drill 0.35mm, track to track 6mil, track to pad 6mil, pad to pad 6mil, via to via 6mil, smd to smd 6mil, copper to edge 40mil, drill to drill 6mil, minimum pad ring 10mil, minimum via ring 8mil, stop-mask expansion 4mil, vias tented up to drill 0mil, thermal gap 10mil
Holes 3 mm at 48.9,74.93 2.54,35.56 33.02,87 65.41,87 30.48,3.17 50.16,3.17

### Footprints (pad centres in the part's own frame; a part is rotated, then mirrored left to right if it is on the bottom)
UD-8X10_NICHICON = smd 3.3 x 1.3: + 3.125,0; - -3.125,0
C2012 = smd 1.3 x 1.5: 1 -0.85,0; 2 0.85,0
UD-6,3X7,7_NICHICON = smd 2.8 x 1: + 2.35,0; - -2.35,0
TO236 = smd 1 x 1.2: A -1,-1; C 0,1; NC 1,-1
SOD-123_MINI-SMA = smd 1.5 x 2.1: A 1.8,0; C -1.8,0
R1210 = smd 1.6 x 2.7: 1 -1.4,0; 2 1.4,0
SOT223 = smd 1.219 x 2.235: 1 -2.311,-3.099; 2 0,-3.099; 3 2.311,-3.099 | smd 3.6 x 2.2: 4 0,3.099
TQFP44 = smd 1.5 x 0.5: 1 -5.8,4; 2 -5.8,3.2; 3 -5.8,2.4; 4 -5.8,1.6; 5 -5.8,0.8; 6 -5.8,0; 7 -5.8,-0.8; 8 -5.8,-1.6; 9 -5.8,-2.4; 10 -5.8,-3.2; 11 -5.8,-4; 23 5.8,-4; 24 5.8,-3.2; 25 5.8,-2.4; 26 5.8,-1.6; 27 5.8,-0.8; 28 5.8,0; 29 5.8,0.8; 30 5.8,1.6; 31 5.8,2.4; 32 5.8,3.2; 33 5.8,4 | smd 0.5 x 1.5: 12 -4,-5.8; 13 -3.2,-5.8; 14 -2.4,-5.8; 15 -1.6,-5.8; 16 -0.8,-5.8; 17 0,-5.8; 18 0.8,-5.8; 19 1.6,-5.8; 20 2.4,-5.8; 21 3.2,-5.8; 22 4,-5.8; 34 4,5.8; 35 3.2,5.8; 36 2.4,5.8; 37 1.6,5.8; 38 0.8,5.8; 39 0,5.8; 40 -0.8,5.8; 41 -1.6,5.8; 42 -2.4,5.8; 43 -3.2,5.8; 44 -4,5.8
SO08 = smd 0.6 x 2.2: 1 -1.905,-2.6; 2 -0.635,-2.6; 3 0.635,-2.6; 4 1.905,-2.6; 5 1.905,2.6; 6 0.635,2.6; 7 -0.635,2.6; 8 -1.905,2.6
SO14 = smd 0.6 x 2.2: 1 -3.81,-2.6; 2 -2.54,-2.6; 3 -1.27,-2.6; 4 0,-2.6; 5 1.27,-2.6; 6 2.54,-2.6; 7 3.81,-2.6; 8 3.81,2.6; 9 2.54,2.6; 10 1.27,2.6; 11 0,2.6; 12 -1.27,2.6; 13 -2.54,2.6; 14 -3.81,2.6
ESP32-DEVKIT = drill 1: 3V3 -17.58,16.5; DNC1 -17.58,-21.6; DNC2 -17.58,-24.14; DNC3 -17.58,-26.68; DNC4 7.19,-29.22; DNC5 7.19,-26.68; DNC6 7.19,-24.14; EN -17.58,13.96; GND -17.58,-16.52; GND2 7.19,1.26; GND3 7.19,16.5; IO0 7.19,-16.52; IO1 7.19,8.88; IO2 7.19,-19.06; IO3 7.19,6.34; IO4 7.19,-13.98; IO5 7.19,-6.36; IO12 -17.58,-13.98; IO13 -17.58,-19.06; IO14 -17.58,-11.44; IO15 7.19,-21.6; IO16 7.19,-11.44; IO17 7.19,-8.9; IO18 7.19,-3.82; IO19 7.19,-1.28; IO21 7.19,3.8; IO22 7.19,11.42; IO23 7.19,13.96; IO25 -17.58,-3.82; IO26 -17.58,-6.36; IO27 -17.58,-8.9; IO32 -17.58,1.26; IO33 -17.58,-1.28; IO34 -17.58,6.34; IO35 -17.58,3.8; IO36 -17.58,11.42; IO39 -17.58,8.88; VIN -17.58,-29.22
TSSOP14 = smd 0.9 x 0.35: 1 -2.875,1.95; 2 -2.875,1.3; 3 -2.875,0.65; 4 -2.875,0; 5 -2.875,-0.65; 6 -2.875,-1.3; 7 -2.875,-1.95; 8 2.875,-1.95; 9 2.875,-1.3; 10 2.875,-0.65; 11 2.875,0; 12 2.875,0.65; 13 2.875,1.3; 14 2.875,1.95
1X02 = drill 1.016 long: 1 -1.27,0; 2 1.27,0
1X03 = drill 1.016 long: 1 -2.54,0; 2 0,0; 3 2.54,0
1X05 = drill 1.016 long: 1 -5.08,0; 2 -2.54,0; 3 0,0; 4 2.54,0; 5 5.08,0
JP1 = drill 0.914 long: 1 0,-1.27; 2 0,1.27
JP3Q = drill 0.914 octagon: 1 -2.54,-1.27; 2 -2.54,1.27; 3 0,-1.27; 4 0,1.27; 5 2.54,-1.27; 6 2.54,1.27
1X01 = drill 1.016 octagon: 1 0,0
1X04 = drill 1.016 long: 1 -3.81,0; 2 -1.27,0; 3 1.27,0; 4 3.81,0
CHIPLED_0805 = smd 1.2 x 1.2: A 0,-1.05; C 0,1.05
CTS406 = smd 1.9 x 1.4: 1 -2.2,-1.2; 2 2.2,-1.2; 3 2.2,1.2; 4 -2.2,1.2
SOT23 = smd 1 x 1.4: 1 -0.95,-1.1; 2 0.95,-1.1; 3 0,1.1
TO263 = smd 1 x 3.4: 1 -2.54,-6.6; 2 2.54,-6.6 | smd 6.8 x 9.6: 3 0,3.5
M2012 = smd 1.3 x 1.6: 1 -0.95,0; 2 0.95,0
FE06 = drill 0.813 long: 1 -6.35,0; 2 -3.81,0; 3 -1.27,0; 4 1.27,0; 5 3.81,0; 6 6.35,0
42TL = drill 0.7 pad 1.3: 1 -2.54,-6.096; 2 0,-6.068; 3 2.54,-6.096; 4 2.54,6.096; 5 0,6.096; 6 -2.54,6.096 | hole 1.9: -7.353,0; 7.353,0
UMAX8 = smd 1.067 x 0.356: 1 -2.134,0.965; 2 -2.134,0.33; 3 -2.134,-0.33; 4 -2.134,-0.965; 5 2.134,-0.965; 6 2.134,-0.33; 7 2.134,0.33; 8 2.134,0.965
057-006-1 = drill 1 octagon: 1 -2.54,-1.27; 2 -2.54,1.27; 3 0,-1.27; 4 0,1.27; 5 2.54,-1.27; 6 2.54,1.27
STX3100 = drill 1.5 pad 2.54: 1 2.7,-0.1 | drill 1.5: 2 7.7,5; 3 7.7,2.3; 4 7.7,-2.5; 5 7.7,-5.2 | hole 1.5: 2.7,4.9; 2.7,-5.1; 7.7,-0.1

### Placement (x,y rotation side)
C1  62.99,11.18 270 top
C2  32.38,17.14 90 bottom
C3  39.37,17.14 90 bottom
C4  46.35,17.14 90 bottom
C5  35.56,17.14 90 bottom
C6  42.55,17.14 90 bottom
C7  49.53,17.14 90 bottom
C8  33.66,12.7 270 top
C9  40.64,12.7 270 top
C10  47.62,12.7 270 top
C11  15.75,63.63 0 bottom
C12  15.75,65.79 0 bottom
C13  18.41,56.52 90 bottom
C14  20.95,81.92 0 top
C15  26.67,26.67 180 top
C16  26.67,19.05 180 top
C17  19.68,11.43 270 top
C18  19.68,11.43 270 bottom
C19  16.51,16.51 180 top
C20  16.51,26.67 180 top
C21  16.51,29.21 180 top
C22  8.89,30.48 270 top
C23  5.71,30.48 270 top
C24  11.43,30.48 90 top
C25  3.17,30.48 270 top
C26  14.61,15.24 270 bottom
C27  26.67,26.67 0 bottom
C28  26.67,19.05 0 bottom
C29  32.38,37.47 90 bottom
C30  54.61,36.2 270 bottom
C31  39.37,27.94 180 bottom
C32  62.87,27.94 180 bottom
D1  61.72,18.8 180 bottom
D2  21.59,24.13 0 bottom
D3  21.59,21.59 0 bottom
F2  53.98,8.89 90 top
IC1  33.66,10.16 180 bottom
IC2  40.64,10.16 180 bottom
IC3  47.62,10.16 180 bottom
IC4  15.24,57.78 270 top
IC5  21.59,25.4 0 top
IC6  13.97,22.86 90 bottom
IC7  50.16,36.2 0 bottom
IC8  10.16,57.78 180 top
IC9  8.26,24.13 270 top
JP1  64.14,3.81 180 top
JP2  56.52,3.81 180 top
JP3  39.37,3.81 180 top
JP4  24.77,73.03 180 top
JP5  17.78,5.08 270 top
JP6  22.86,4.06 90 top
JP7  26.54,4.06 270 top
JP8  33.02,76.2 90 top
JP9  33.02,81.92 0 top
JP10  65.41,76.2 270 top
JP11  65.41,81.92 0 top
JP12  27.94,36.2 180 top
JP13  3.81,20.32 90 top
LED1  8.26,87 0 top
LED2  10.79,87 0 top
LED3  13.34,87 180 top
LED4  15.88,87 180 top
Q1  59.18,11.18 180 bottom
Q2  21.59,64.77 0 bottom
Q3  24.77,68.58 180 top
Q4  40.01,55.88 90 top
Q5  40.01,31.75 90 top
Q6  40.01,43.81 90 top
Q7  58.42,55.88 270 top
Q8  58.42,31.75 270 top
Q9  58.42,43.81 270 top
R1  58.55,18.8 270 bottom
R2  15.88,83.19 90 top
R3  8.26,83.19 270 top
R4  10.79,83.19 270 top
R5  13.34,83.19 270 top
R6  24.77,65.41 180 top
R7  19.68,45.09 270 top
R8  22.23,45.09 90 top
R9  17.14,11.43 90 top
R10  17.14,11.43 90 bottom
R11  26.67,21.59 180 top
R12  26.67,24.13 0 top
R13  21.59,16.51 180 top
R14  21.59,19.05 0 top
R15  22.23,11.43 90 top
R16  22.23,11.43 90 bottom
R17  26.67,8.89 90 bottom
R18  16.51,19.05 0 top
R19  16.51,21.59 180 top
R20  16.51,24.13 180 top
R21  8.89,30.48 90 bottom
R22  6.99,15.24 90 bottom
R23  11.43,30.48 270 bottom
R24  9.53,15.24 270 bottom
R25  13.72,30.48 270 bottom
R26  12.06,15.24 90 bottom
R27  21.59,29.84 90 bottom
R28  22.23,26.67 180 bottom
R29  26.67,24.13 180 bottom
R30  26.67,21.59 180 bottom
R31  24.13,54.61 90 top
R32  35.56,40.64 180 bottom
R33  35.56,31.75 180 bottom
R34  40.64,40.64 180 bottom
R35  40.64,37.47 180 bottom
R36  40.64,31.75 180 bottom
R37  40.64,34.29 180 bottom
R38  45.72,38.73 270 bottom
R39  46.99,42.55 180 bottom
R40  45.72,33.66 90 bottom
R41  47.62,29.84 180 bottom
R42  51.44,29.84 180 bottom
R43  50.8,42.55 180 bottom
R44  36.2,53.34 180 bottom
R45  36.2,46.99 180 bottom
R46  60.96,53.34 0 bottom
R47  60.96,46.99 0 bottom
R48  35.56,27.94 180 bottom
R49  59.05,27.94 180 bottom
R50  40.64,53.34 180 bottom
R51  40.64,46.99 180 bottom
R52  56.52,53.34 0 bottom
R53  56.52,46.99 0 bottom
R54  19.68,40.64 90 top
R55  22.23,40.64 270 top
SV1  18.41,79.38 0 top
TR1  40.64,69.85 180 top
TR2  57.78,69.85 180 top
U1  35.56,36.2 90 bottom
X1  15.24,71.75 180 top
X2  7.62,1.27 90 top
X3  42.55,89.53 270 top
X4  55.24,89.53 270 top

### Tracks (layer width: path | path; a pad name or v marks a point on that pad's centre or on a via)
!POWERSTAGE-CS  (via drill 0.35)
  Top 0.305: v6.99,60.96 6.99,75.37 6.05,76.3 4.84,76.3 4.66,76.48 4.66,77.69 IC8.IO15 | v11.43,60.96 11.4,60.98 IC4.13
  Bottom 0.254: 20.95,46.82 20.95,46.99 20.95,50.34 14.12,57.17 14.12,60.49 9.82,64.79 9.25,64.79 8.87,64.41 8.87,60.98 8.89,60.96
  Bottom 0.305: v11.43,60.96 8.89,60.96 v6.99,60.96 | U1.3 35.08,33.91 35.08,33.4 34.9,33.22 32.82,33.22 26.04,40.01 26.04,41.91 24.36,43.59 24.14,43.59 20.98,46.75 20.98,46.96 20.95,46.99
+3V3
  Top 0.203: IC8.3V3 27.74,36.4 JP12.1
  Bottom 0.305: JP13.3 2.54,21.59 1.91,22.23 1.91,31.11 8.89,38.1 26.04,38.1 JP12.1
+5V  (via drill 0.35, 1)  (1 unrouted)
  Top 0.203: v23.5,35.56 23.5,40.46 25.4,42.36 25.4,45.35 25.03,45.72 24.77,45.72 v23.5,46.99 | C14.2 26.89,87 IC8.VIN
  Top 0.305: IC9.1 10.21,24.77 | IC9.3 8.9,26.07 10.21,24.77 | 28.57,29.84 v28.57,28.57 | v28.57,28.57 28.57,24.13 | 28.57,24.13 R12.2 | Q3.2 23.82,69.61 23.77,69.57 | 23.82,65.52 R6.2 | 23.77,69.57 22.05,67.85 22.05,67.28 23.82,65.52 | 23.77,69.57 23.77,70.6 23.04,71.33 23.04,72.57 JP4.1 22.23,76.83 SV1.5 21.8,79.8 C14.2 21.06,82.66 21.06,82.79 20.88,82.97 18.49,82.97 16.8,81.28 14.95,81.28 14.77,81.46 14.77,82.27 14.07,82.97 R5.2 R4.2 10.48,82.55 8.57,82.55 R3.2 | v23.5,62.23 23.5,65.2 23.82,65.52 | v28.57,28.57 29.84,27.3 41.27,27.3 v44.45,30.48 | JP3.3 39.37,5.71 37.47,7.62 37.47,10.16 | 37.47,10.16 v37.47,17.14 | 37.47,10.16 33.84,10.16 C8.+ 30.29,10.35 28.57,12.06 28.57,15.4 | 22.23,15.4 20.57,15.4 | 19.21,15.4 14.44,15.4 13.97,15.88 v13.97,17.78 | R13.2 20.64,15.88 20.57,15.81 20.57,15.4 | v19.18,15.37 19.21,15.4 | 19.21,15.4 20.57,15.4 | R16.2 22.23,15.4 | v13.34,22.23 12.74,22.23 10.21,24.77 | 22.23,15.4 28.57,15.4 | 28.57,24.13 28.57,15.4
  Top 0.406: C21.1 18.48,29.21 IC5.8 19.68,29.84 20.32,30.48 v24.13,30.48 27.94,30.48 28.57,29.84 | v13.97,17.78 13.34,18.41 v13.34,22.23
  Bottom 0.203: v23.5,62.23 v23.5,46.99
  Bottom 0.305: v23.5,35.56 23.5,30.48 | R38.2 R40.2 45.4,34.6 44.45,33.66 v44.45,30.48 | v37.47,17.14 36.62,16.3 C5.1 | v13.97,17.78 14.61,17.14 C26.1 | R16.2 22.23,14.61 21.46,15.37 v19.18,15.37 | U1.8 36.52,37.16 36.2,36.83 34.92,36.83 | 34.92,36.83 35.23,37.13 U1.6 | C29.1 32.6,36.83 34.92,36.83
  Bottom 0.406: v24.13,30.48 23.5,30.48 21.91,30.48 R27.2 | IC6.4 12.7,22.86 v13.34,22.23
  Bottom 0.508: 34.92,16.51 35.34,16.51 C5.1 35.97,15.89 IC1.3
+9V1  (via drill 0.35, 1)  (2 unrouted)
  Top 0.305: v55.88,33.66 v55.88,26.67 | Q5.2 v43.18,34.29 | JP3.2 41.91,10.16 | 41.91,10.16 41.91,12.06 44.45,14.61 v44.45,17.14 | 40.83,10.16 41.91,10.16
  Bottom 0.305: IC7.8 53.28,38.8 54.61,37.47 C30.1 55.35,36.3 55.49,36.3 55.88,35.91 v55.88,33.66 | R36.2 43.18,31.75 | 43.18,31.75 v43.18,34.29 | 43.18,31.75 43.18,29.84 45.09,27.94 45.09,23.07 45.51,22.65 | v55.88,26.67 55.88,22.23 54.61,22.23 | 43.6,16.3 v44.45,17.14 44.45,23.5 44.56,23.6
  Bottom 0.406: C31.2 44.56,23.6 45.51,22.65 45.94,22.23 54.61,22.23
  Bottom 0.508: IC2.3 42.95,15.89 C6.1 42.12,16.3
+9V2  (via drill 0.35, 1)
  Top 0.305: v43.81,37.47 v58.42,37.47 | Q8.2 52.7,29.21 53.98,27.94 53.98,26.04 54.61,25.4 v60.96,25.4 | v49.91,10.29 47.69,10.29 C10.+
  Bottom 0.305: 63.5,25.4 v60.96,25.4 60.96,21.59 54.83,21.59 50.59,17.35 50.59,17.22 50.41,17.04 50.27,17.04 C7.1 | C32.2 63.72,34.71 60.96,37.47 v58.42,37.47 | v43.81,37.47 43.81,40.01 43.18,40.64 R34.2 | JP3.1 46.3,5.66 49.55,5.66 49.94,6.04 IC3.3 49.91,13.23 v49.91,10.29
  Bottom 0.406: 63.5,25.4 63.5,27.73 C32.2
  Bottom 0.508: IC3.3 49.94,15.89 C7.1 49.31,16.51
+VBATT  (via drill 0.6)
  Top 0.203: R7.2 R54.2 19.68,41.5 18.63,40.45 18.63,37.25 v20.32,35.56
  Bottom 0.305: 36.83,11.43 JP3.4 38.73,1.91 52.07,1.91 JP2.3 | v20.32,35.56 21.59,36.83 24.77,36.83 31.34,30.25 31.34,18.79 31.33,18.77 31.33,17.22 31.34,17.2 31.34,15.25
  Bottom 0.508: C4.1 45.31,15.25 IC3.1 45.31,11.66 45.09,11.43 38.1,11.43 | C3.1 38.33,15.25 IC2.1 38.1,13.03 38.1,11.43 | C2.1 31.34,15.25 IC1.1 31.11,13.03 31.11,11.43 36.83,11.43 38.1,11.43
ATMEGA-PWRCTL
  Top 0.305: IC8.IO12 27.74,71.7 Q3.1 R6.1
ATMEGA-RXD  (via drill 0.35)
  Top 0.305: 12.84,68.19 v12.83,68.2 | v12.83,68.2 12.83,68.83 12.84,68.85 11.64,70.05 11.64,73.46 17.14,78.97 SV1.3 | v12.83,68.2 12.83,63.6 IC4.9
  Bottom 0.305: SV1.3 19.05,81.28 24.89,81.28 26.67,79.5 26.67,77.92 IC8.IO13
ATMEGA-TXD  (via drill 0.35)
  Top 0.305: IC8.IO19 v4.45,59.05 | IC4.10 12.06,63.61 v12.06,67.31 12.04,67.33 12.04,69 11.18,69.86 11.18,73.65 14.61,77.07 SV1.2
  Bottom 0.305: v12.06,67.31 5.08,67.31 4.45,66.67 v4.45,59.05
AUDIO-CHA  (via drill 0.35)
  Top 0.203: 16.84,42.22 16.84,36.5 19.23,34.11 24.55,34.11 25.64,33.02 v26.04,33.02
  Top 0.406: IC4.30 16.84,42.22
  Bottom 0.4: R29.1 D2.C
  Bottom 0.406: R29.1 25.72,26.57 C27.2 26.04,26.89 v26.04,33.02
AUDIO-CHB  (via drill 0.35)
  Top 0.203: 17.64,42.69 17.64,36.34 19.51,34.47 25.48,34.47 27.56,32.38 v27.94,32.38
  Top 0.406: IC4.31 17.64,42.69
  Bottom 0.4: R30.1 D3.C
  Bottom 0.406: R30.1 25.72,19.15 C28.2 | D3.C 24.77,22.97 28.42,22.97 28.63,23.18 28.63,31.7 v27.94,32.38
CURRSENSE  (via drill 0.35)
  Top 0.305: IC8.IO35 25.54,56.19 24.13,56.19 | 24.13,56.19 IC4.37 | 24.13,56.19 R31.2
  Top 0.406: Q9.2 46.74,46.35 Q6.2 51.82,51.57 Q7.2 46.74,58.42 Q4.2 46.35,58.42 v46.35,60.33
  Bottom 0.406: IC8.IO35 33.66,53.98 40.01,60.33 v46.35,60.33
ESP32-SCA  (via drill 0.35)
  Top 0.203: 6.3,27.89 6.73,28.32 6.73,28.46 7.1,28.83 7.24,28.83 7.62,29.21
  Top 0.254: IC9.7 6.3,27.89 | 1.91,46.8 1.91,39.36 2.54,38.73 6.99,38.73 7.62,38.1 v7.62,34.29 7.62,29.21
  Top 0.305: IC8.IO1 2.97,47.86 1.91,46.8
  Bottom 0.305: v7.62,34.29 6.35,33.02 6.35,20.32 5.08,19.05 JP13.2
ESP32-SCL  (via drill 0.35)
  Top 0.203: v5.08,37.47 5.08,34.99 2.17,32.09 2.17,27.67 2.54,27.3 3.81,27.3 6.96,24.16 IC9.9
  Top 0.305: IC9.9 6.96,18.39 5.08,16.51 JP13.1
  Bottom 0.203: v5.08,37.47 5.08,64.14 7.63,66.69 11.8,66.69 11.8,66.68 14.03,66.68 14.28,66.92 24.84,66.92 25.08,66.69 IC8.IO27
GND  (via drill 0.35)  (1 unrouted)
  other vias: 14.1,68.2 7.62,59.05 15.37,59.56 22.23,35.56 7.37,28.19 24.77,35.56 10.79,76.83 23.75,42.67 17.65,59.56 44.45,56.52 30.48,39.37 31.75,63.5 48.26,31.75 37.47,36.2 44.45,9.53 9.14,28.19 24.51,25.65 17.14,32.38 17.78,14.61 8.26,17.78 24.77,17.14 29.84,20.32 33.02,20.32
  pour Top (isolate 0.254): 69.85,91.44 69.85,-1.91 -1.27,-1.91 -1.27,91.44
  pour Bottom: -0.64,91.44 70.48,91.44 70.48,-0.64 -0.64,-0.64
LCD-DB4/SW-DOWN
  Top 0.305: IC8.IO16 5.84,66.35 5.84,50.21 7.34,48.72 8.09,48.72 8.84,49.47 8.84,49.59 IC4.23
LCD-DB5/SW-OK  (via drill 0.35)
  Top 0.305: IC8.IO23 v7.62,43.81
  Top 0.4: IC4.24 12.04,49.51 11.43,48.9 v10.79,48.9
  Bottom 0.203: v10.79,48.9 10.79,46.99 v7.62,43.81
LCD-DB6/SW-UP
  Top 0.305: IC8.IO17 5.39,64.27 5.39,50.02 7.2,48.21 11.46,48.21 12.6,49.35 12.6,51.74 IC4.25
LCD-DB7/SW-MENU
  Top 0.305: IC4.26 13.39,51.74 13.39,49.5 11.65,47.76 7.01,47.76 4.93,49.83 4.93,56.48 3.41,58.01 2.53,58.01 1.91,58.63 1.91,59.5 2.97,60.56 IC8.IO18
LCD-E  (via drill 0.35)
  Top 0.305: v7.62,49.4 8.12,49.4 8.38,49.66 8.38,54.16 8.56,54.34 9.2,54.34 IC4.21 | v7.62,46.35 IC8.IO22 | v7.62,49.4 | v7.62,49.4 7.41,49.4
  Bottom 0.305: v7.62,46.35 v7.62,49.4
LCD-RS  (via drill 0.35)
  Top 0.203: v19.05,50.16 20.32,48.9 23.48,48.9 23.48,48.91
  Top 0.305: 23.48,48.91 IC8.IO39 | IC4.22 9.53,53.7 v9.53,52.07
  Bottom 0.203: v9.53,52.07 17.14,52.07 v19.05,50.16
LCD-RW  (via drill 0.35)
  Top 0.203: v19.05,49.15 19.94,48.26 26.04,48.26 27.74,46.55
  Top 0.305: IC4.20 9.2,55.14 8.56,55.14 6.99,53.56 v6.99,51.05
  Bottom 0.203: v6.99,51.05 17.14,51.05 v19.05,49.15
LED-OUTA
  Top 0.305: IC4.15 9.2,59.63 8.56,59.63 7.93,60.27 7.93,64.15 8.26,64.48 8.26,79.36 6.35,81.27 6.35,86.36 8.04,88.05 LED1.C
LED-OUTB
  Top 0.305: IC4.14 9.2,60.43 8.56,60.43 8.38,60.61 8.38,63.96 8.89,64.47 8.89,79.72 7.15,81.46 7.15,84.29 6.99,84.45 7.15,84.62 7.15,86.47 7.53,86.85 9.38,86.85 10.57,88.05 LED2.C
MA-IN1
  Top 0.305: IC9.6 7.12,26.84 7.12,26.43 7.3,26.25 7.71,26.25 10.79,23.16 10.79,14.61 12.06,13.34 18.63,13.34 C17.1 20.43,12.28 R15.1 22.12,10.58
MA-IN2  (via drill 0.35)
  Top 0.305: v18.67,27.69 17.65,26.67 C20.1 | v8.89,22.86 8.89,21.27 IC9.12 8.9,18.1 8.94,18.06 8.94,11.48 v8.89,11.43
  Bottom 0.305: v8.89,22.86 8.89,26.05 8.46,26.48 8.46,28.08 7.79,28.75 7.79,32.21 9.92,34.34 17.81,34.34 18.21,33.94 18.21,28.15 v18.67,27.69 | R16.1 20.43,12.28 C18.1 18.63,13.34 16.22,13.34 14.31,11.43 v8.89,11.43
MA-OUT1  (via drill 0.35)
  Top 0.203: 24.39,33.7 17.57,33.7 v17.53,33.66
  Top 0.305: C22.2 8.26,29 IC9.4 | C24.1 10.69,30.38 10.55,30.38 10.38,30.55 10.38,33.87 10.79,34.29 13.08,34.29 v13.72,33.66 | IC4.36 21.29,55.14 21.92,55.14 22.09,54.96 22.09,53.41 25.54,49.96 28.18,49.96 28.8,49.34 28.8,45.93 28.18,45.31 26.1,45.31 26.1,35.19 28.62,32.67 28.62,32.1 28.22,31.7 26.39,31.7 24.39,33.7
  Top 0.406: C24.1 C22.2
  Bottom 0.203: v17.53,33.66 v13.72,33.66
MA-OUT2
  Top 0.305: IC9.14 10.16,21.3 10.16,23.15 7.52,25.79 6.46,25.79 5.71,26.54 C23.2
  Top 0.406: C25.1 3.6,31.33 5.29,29.63 C23.2
N$2  (via drill 0.35)
  Top 0.203: R7.1 R8.2 22.48,46.29 v22.48,47.5 | v22.48,51.44 21.04,52.87 IC4.34
  Bottom 0.203: v22.48,47.5 v22.48,51.44
N$3
  Bottom 0.305: JP7.1 26.67,5.46 R17.1
N$4  (via drill 0.35)
  Top 0.203: v24.77,45.09 24.77,42.23 R55.2 R54.1 | IC8.IO34 v25.4,51.44
  Bottom 0.203: v25.4,51.44 24.13,50.16 24.13,45.72 v24.77,45.09
N$5  (via drill 0.35)
  Top 0.203: 15.24,57.78 16.51,59.05 16.51,62.56 16.49,62.58 16.48,62.58 16.04,63.03
  Top 0.305: IC4.38 20.03,56.98 19.81,56.77 19.81,53.59 19.56,53.34 18.41,53.34 | 18.41,53.34 16.13,53.34 | 16.13,53.34 14.48,53.34 | 14.48,53.34 11.05,53.34 10.79,53.59 10.79,57.78 | IC4.29 16.04,53.25 16.13,53.34 | IC4.27 14.44,53.3 14.48,53.34 | 10.79,57.78 IC4.17 | v18.41,53.98 18.41,53.34 | 16.04,63.03 IC4.5 16.04,64.52 15.81,64.76 15.81,67 v15.24,67.56 | JP4.2 Q3.3 22.82,67.48 v22.73,67.56 | v17.53,67.56 17.53,70.23 X1.2 | 10.79,57.78 15.24,57.78
  Bottom 0.305: C13.1 v18.41,53.98 | v22.73,67.56 v17.53,67.56 | v17.53,67.56 17.4,67.56 | v17.53,67.56 v15.24,67.56
N$6
  Top 0.406: Q5.3 43.18,38.42 43.18,61.21 TR1.5
N$7
  Top 0.305: LED4.C R2.2
N$8
  Top 0.305: Q8.3 61.92,36.51 59.69,38.73 56.52,38.73 55.88,39.37 55.88,60.8
  Top 0.406: 55.88,60.8 54.24,62.45 54.24,64.17 54.83,64.76 55.66,64.76 56.67,63.75 TR2.5
N$9
  Top 0.61: JP11.1 62.51,80.64 TR2.2
N$12
  Top 0.203: X2.5 15.44,6.35 17.78,6.35 JP5.4
N$13
  Top 0.203: X2.2 5.24,6.35 13.97,6.35 15.24,5.08 JP5.3
N$14  (via drill 0.35)
  Top 0.203: C25.2 v3.17,27.94
  Bottom 0.203: 6.99,16.51 R22.2 | v3.17,27.94 v3.17,26.04
  Bottom 0.305: IC6.3 10.71,20.93 9.72,20.93 6.78,17.98 | v3.17,26.04 4.01,25.2 5.01,25.2 5.64,24.57 5.64,21.15 4.61,20.12 2.61,20.12 1.98,19.49 1.98,18.61 2.61,17.98 6.78,17.98 | 6.78,17.98 6.99,17.78 6.99,16.51 | R22.2 5.08,14.29 5.08,12.7 5.71,12.06 8.56,12.06 8.61,12.11 14.35,12.11 16.03,13.79 18.49,13.79 18.49,15.65 18.89,16.05 21.43,16.05 22.68,14.79 22.68,13.83 R17.2
N$15
  Top 0.305: R9.1 19.05,8.57 JP5.2
  Top 0.406: R9.1 17.14,10.16
N$16
  Top 0.61: TR1.1 42.23,75.95 40.37,74.08 37.33,74.08 36.47,74.93 JP8.1 32,74.93 30.28,76.65 30.28,78.29 31.11,79.13 31.11,83.64 31.82,84.35 39.27,84.35 41.75,86.83 X3.1
N$17  (via drill 0.35)
  Top 0.203: v14.1,61.59 13.64,62.05 IC4.8
  Bottom 0.203: v14.1,61.59 13.46,62.23 13.46,64.02
  Bottom 0.305: Q2.3 16.78,65.97 C12.1 15.85,65.04 15.85,64.91 15.62,64.68 14.12,64.68 13.46,64.02
N$18  (via drill 0.35)
  Top 0.406: v46.35,55.24 46.35,53.59 Q4.1
  Bottom 0.406: R50.2 44.45,53.34 v46.35,55.24
N$19  (via drill 0.35)
  Top 0.406: v46.35,44.45 46.6,44.45 Q6.1
  Bottom 0.406: R51.2 43.81,46.99 v46.35,44.45
N$20
  Top 0.61: JP11.2 60.96,83.19 60.24,82.47 X4.2
N$21  (via drill 0.35)
  Top 0.305: Q5.1 46.6,28.82 45.09,27.3 v43.18,27.3
  Bottom 0.305: v43.18,27.3 41.27,29.21 37.78,29.21 R48.2 C31.1
N$22  (via drill 0.35)
  Top 0.305: v48.26,35.56 47.96,35.56 47.91,35.51 44.17,35.51 44.12,35.56 v43.81,35.56
  Bottom 0.305: R33.2 R36.1 41.59,33.65 R37.2 42.86,35.56 v43.81,35.56 | IC7.3 49.53,34.92 48.9,35.56 v48.26,35.56
N$23
  Top 0.305: LED2.A R4.1
N$24  (via drill 0.35)
  Top 0.406: v52.07,60.33 arc90 51.82,60.08 Q7.1
  Bottom 0.406: R52.2 52.7,53.34 52.07,53.98 v52.07,60.33
N$25  (via drill 0.35)
  Top 0.406: Q9.1 51.82,47.88 v51.44,48.26
  Bottom 0.406: R53.2 52.7,46.99 v51.44,48.26
N$26
  Top 0.61: TR2.1 61.85,77.47 JP10.1 65.41,78.28 67.28,80.16 67.28,83.67 66.6,84.35 58.52,84.35 56.04,86.83 X4.1
N$27  (via drill 0.35)
  Top 0.305: v54.61,32.38 52.7,34.29 Q8.1
  Bottom 0.305: C32.1 R49.2 60.01,29.53 57.15,32.38 v54.61,32.38
N$28  (via drill 0.35)
  Top 0.305: v44.45,36.2 v47.62,36.2
  Bottom 0.305: R32.2 R34.1 41.59,38.74 R35.2 42.86,36.2 v44.45,36.2 | v47.62,36.2 48.26,36.83 IC7.5
N$29
  Top 0.305: LED1.A R3.1
N$30
  Bottom 0.305: JP5.1 17.14,8.26 R10.1
N$31  (1 unrouted)
  Bottom 0.305: JP1.1 65.66,4.07
N$32  (via drill 0.35)
  Top 0.203: v15.49,61.59 14.44,62.65 IC4.7
  Bottom 0.203: v15.49,61.59 16.6,62.7 16.6,63.5
  Bottom 0.305: Q2.1 22.16,63.57 21.15,64.58 17.55,64.58 C11.1 16.6,63.5 16.6,63.33
N$33  (1 unrouted)
  Bottom 0.305: Q1.4 59.18,7.37
  Bottom 0.508: Q1.2 Q1.4
N$34
  Top 0.406: Q4.3 36.51,62.16 TR1.4
N$35
  Top 0.305: JP8.2 34.29,77.47
  Top 0.61: TR1.3 37.34,76.7 | 37.34,76.7 36.58,77.47 34.29,77.47 33.66,77.47 | X3.5 37.34,76.7
N$36
  Top 0.406: TR2.4 55.24,62.23 61.59,55.88 62.23,56.52 62.23,55.24 61.92,55.55 Q7.3
  Bottom 0.61: 55.88,63.12 TR2.4
N$37
  Top 0.61: JP10.2 63.5,73.03 56.52,73.03 55.24,74.3 TR2.3 50.05,81.15 X4.5
N$38
  Top 0.406: Q9.3 61.92,47.18 67.08,52.33 67.08,59.43 66.87,59.64 64.44,59.64 TR2.6
  Bottom 0.61: 60.71,63.75 TR2.6
N$39
  Top 0.406: 36.51,47.18 36.57,47.25 | 36.57,47.25 41.66,52.33 41.66,59.43 41.45,59.64 40.69,59.64 39.37,60.96 39.37,64.77 40.01,65.41 42.55,65.41 43.18,64.77 TR1.6 | Q6.3 arc90 36.83,44.14 | 36.83,44.14 36.83,44.45 36.2,44.45 arc-90 36.51,44.14 | 36.51,44.14 Q6.3 | 36.57,47.25 arc90 36.51,47.18 | 36.51,47.18 36.51,44.14 | Q6.3 arc90 36.2,43.51 36.2,42.55 arc90 36.83,43.18 36.83,44.14
N$40
  Bottom 0.305: IC7.2 50.8,30.16 R42.1 R41.2 R40.1
N$41
  Bottom 0.305: IC7.6 49.53,42.55 | 49.53,42.55 R39.2 47.94,42.23 47.62,41.91 47.62,41.59 R38.1 | R43.1 49.53,42.55
N$42
  Bottom 0.305: R33.1 35.89,33.03 U1.2
N$43
  Bottom 0.508: Q1.1 56.87,16.17 R1.2 59.5,17.85 59.82,18.16 59.82,18.89 D1.A
N$48
  Top 0.61: JP9.2 36.46,83.19 36.69,83.42 41.1,83.42 41.59,83.91 45.47,83.91 X3.2
N$49
  Top 0.4: C19.2 15.66,18.95 R18.1
N$51
  Top 0.61: TR1.2 39.64,75.92 38.56,74.84 37.64,74.84 36.23,76.25 31.75,76.25 31.04,76.97 31.04,77.97 33.02,79.96 JP9.1
N$53
  Bottom 0.203: R26.1 10.16,16.19 R24.1
  Bottom 0.254: R24.1 9.53,19.68 10.16,20.32 IC6.2
N$54
  Bottom 0.203: R26.2 12.06,19.05
  Bottom 0.4: IC6.1 12.06,19.05 12.7,19.05 15.24,21.59 IC6.12 D3.A
N$57
  Top 0.305: 17.25,12.28 R9.2 18.95,10.58 C17.2
N$60
  Bottom 0.254: R25.1 11.82,29.53 R23.2 9.99,28.09 9.99,26.25 10.15,26.09 10.68,26.09 IC6.6
N$62
  Bottom 0.305: R28.1 21.59,26.98 R27.1
  Bottom 0.4: IC6.13 17.78,20.32 18.41,19.68 20.95,19.68 21.59,20.32 21.59,25.4 21.27,25.71 R28.1 19.05,26.67 17.78,25.4 IC6.9
N$63  (via drill 0.35)
  Top 0.305: v12.06,33.02 12.06,31.33
  Top 0.406: v13.34,24.13 13.34,30.48 12.48,31.33 12.06,31.33 C24.2
  Bottom 0.305: R21.2 10.48,33.02 v12.06,33.02
  Bottom 0.406: v13.34,24.13 IC6.5
N$65
  Bottom 0.305: 17.25,12.28 arc-90 R10.2 18.95,10.58 C18.2
N$69
  Bottom 0.254: R25.2 12.7,28.51 12.7,26.67
  Bottom 0.4: IC6.7 12.7,26.67 15.24,24.13 IC6.10 D2.A
N$71  (via drill 0.35)
  Top 0.203: JP5.6 JP5.5 | 19.43,2.92 JP5.6 | JP6.2 21.84,5.33 JP5.6
  Top 0.305: JP6.2 27.3,9.78 v27.3,13.97 | C16.1 27.3,18.84 v27.3,17.14
  Top 0.406: R11.1 27.62,19.15 C16.1
  Bottom 0.305: v27.3,13.97 v27.3,17.14
N$72
  Top 0.305: R12.1 25.72,24.67 27.62,26.57
  Top 0.4: 27.62,26.77 C15.1
  Top 0.406: R12.1 R11.2
  Top 0.508: 27.62,26.57 C15.1
N$73
  Top 0.4: R14.2 R13.1
  Top 0.406: IC5.3 22.23,19.36 R14.2 C16.2
N$74
  Top 0.4: R18.2 17.46,20.95 R19.1
  Top 0.406: IC5.2 20.95,21.59 20.32,20.95 17.46,20.95
N$75
  Top 0.4: R20.1 17.14,23.82 17.14,23.5 15.56,21.91 R19.2 | IC5.1 19.68,24.13 22.23,26.67 IC5.6
  Top 0.406: 19.68,24.13 R20.1
N$76
  Top 0.203: C20.2 15.66,24.23 R20.2
N$78  (via drill 1)
  Top 0.305: 62.79,8.26 C1.+ 62.99,8.26 | v65.41,11.43 62.99,9.02 62.99,8.26 | JP2.1 59.05,6.99 60.33,8.26 62.99,8.26
  Top 0.508: C1.+ 62.99,7.37
  Bottom 0.305: Q1.3 64.34,11.43 v65.41,11.43
  Bottom 0.508: Q1.3 61.72,14.5 D1.C
N$81
  Top 0.305: R5.1 13.34,84.31 12.43,85.22 12.43,86.67 13.34,87.58 LED3.A
N$85
  Bottom 0.305: U1.7 35.89,39.36 R32.1
PD2  (via drill 0.35)
  Top 0.203: 15.88,33.02 v15.88,43.81
  Top 0.305: v14.22,18.8 14.22,27.94 13.92,28.24 13.92,31.07 15.88,33.02 | v9.53,64.14 10.69,64.14 IC4.11
  Bottom 0.203: 15.88,53.21 15.93,53.16
  Bottom 0.254: 15.93,53.16 16.23,52.86 17.86,52.86 20.11,50.61 20.11,48.71 19.49,48.09 18.24,48.09 15.88,45.72 v15.88,43.81
  Bottom 0.305: IC6.14 16.32,18.8 v14.22,18.8 | v9.53,64.14 11.56,62.1 11.9,62.1 12.57,61.43 12.57,56.52 15.88,53.21
PD3  (via drill 0.35)
  Top 0.203: v14.61,33.02 v14.61,43.81
  Top 0.305: v9.53,62.87 9.53,61.87 IC4.12
  Bottom 0.254: v14.61,33.02 16.57,31.05 IC6.8 | 14.61,52.75 14.91,52.45 17.69,52.45 19.71,50.44 19.71,48.88 19.32,48.49 17.76,48.49 14.61,45.34 v14.61,43.81
  Bottom 0.305: v9.53,62.87 10.75,61.64 11.71,61.64 12.11,61.24 12.11,55.24 14.61,52.75
PFET_A  (via drill 0.35)
  Top 0.305: v35.56,26.04 v52.07,26.04
  Bottom 0.305: IC7.1 52.07,30.16 R42.2 52.07,29.53 v52.07,26.04 | R48.1 34.61,26.98 v35.56,26.04
PFET_B
  Bottom 0.305: R43.2 52.07,42.23 52.07,41.27 50.8,40.01 IC7.7 50.8,38.1 52.7,36.2 52.7,33.66 52.7,33.32 52.7,31.75 56.52,27.94 R49.1
PWR-OUTA-SW1
  Top 0.305: IC4.42 26.32,60.19 IC8.IO25
  Bottom 0.406: R44.2 R50.1 39.69,56.84 41.91,59.05 46.99,59.05 47.62,59.69 47.62,60.96 46.98,61.6 IC8.IO25
PWR-OUTA-SW2
  Top 0.305: IC4.43 21.07,60.96 24.13,60.96 27.32,64.14 IC8.IO26
  Bottom 0.406: IC8.IO26 29.66,62.23 42.55,62.23 42.61,62.16 47.21,62.16 48.18,61.19 48.18,56.04 44.33,52.18 42.34,52.18 R45.2 R51.1
PWR-OUTB-SW1  (via drill 0.35)
  Top 0.305: v18.41,58.55 21,58.55 IC4.40 25.68,58.59 IC8.IO32 | v29.84,56.52 v29.84,66.04
  Bottom 0.305: IC8.IO32 v29.84,56.52 | v29.84,66.04 30.22,65.66 49.27,65.66 57.15,57.78 57.15,53.98 57.78,53.34
  Bottom 0.406: R46.2 57.78,53.34 R52.1
PWR-OUTB-SW2  (via drill 0.35)
  Top 0.305: v19.05,59.31 19.13,59.38 IC4.41 27.42,59.38 IC8.IO33
  Bottom 0.305: IC8.IO33 27.74,60.11 26.68,61.17 26.68,64.58 27.3,65.2 44.89,65.2 48.69,61.4 48.69,54.18 52.7,50.16 56.52,50.16 57.47,49.22 R53.1
  Bottom 0.406: R53.1 R47.2
RESET
  Top 0.305: X1.5 14.18,71.54 14.18,70.05 16.26,67.96 16.26,64.94 16.84,64.37 IC4.4
SPI-MISO
  Top 0.305: IC4.2 18.44,69.65 18.84,70.05 18.84,71.97 X1.1
SPI-MOSI  (via drill 0.35)
  Top 0.203: v19.18,61.34 19.18,63.52 IC4.1
  Top 0.305: X1.4 15.24,71.53 14.18,72.59 14.18,73.46 14.8,74.08 18.66,74.08 19.3,73.45 19.3,69.86 19.24,69.8 IC4.1 | v29.21,44.45 v29.21,40.64
  Bottom 0.254: v19.18,61.34 21.82,58.7 21.82,47.1 24.49,44.43 25.04,44.43 25.06,44.45 26.04,44.45
  Bottom 0.305: IC8.IO14 16.5,69.22 X1.4 | U1.4 32.62,34.06 29.21,37.48 v29.21,40.64 | 26.04,44.45 26.67,45.09 28.57,45.09 v29.21,44.45
SPI-SCK  (via drill 0.35)
  Top 0.203: v17.65,61.34 17.65,63.57 IC4.3
  Top 0.305: X1.3 16.72,71.54 16.72,65.14 17.39,64.46 17.39,63.83 IC4.3
  Bottom 0.203: X1.3 15.91,73.03 16.92,74.03 19.95,74.03 23.5,70.48 28.57,70.48 29.84,69.22
  Bottom 0.254: v17.65,61.34 19.03,59.97 19.32,59.97 21.41,57.87 21.41,46.93 24.32,44.02 25.83,44.02 26.04,43.81
  Bottom 0.305: IC8.IO21 2.97,55.03 1.91,56.09 1.91,69.84 1.91,69.85 2.76,70.71 8.88,70.71 12.26,74.08 13.14,74.08 14.2,73.03 X1.3 | U1.5 30.38,42.55 27.3,42.55 26.04,43.81
STATE  (1 unrouted)
SW-CTL
  Top 0.305: IC8.IO4 6.3,68.43 6.3,57.83 7.95,56.19 IC4.19

### Text on the board
tPlace: shockink! by schani/disdev (r0, 2019)